# Altium project HUB_USB_3.0.PrjPcb (part 2 of 3)

## Sheet USB_HUB1 DN PORT 1_2.SchDoc: USB_HUB 3.0
size A2; DrawnBy: Luca Schenetti; Revision: A; SheetNumber: 6; SheetTotal: 10
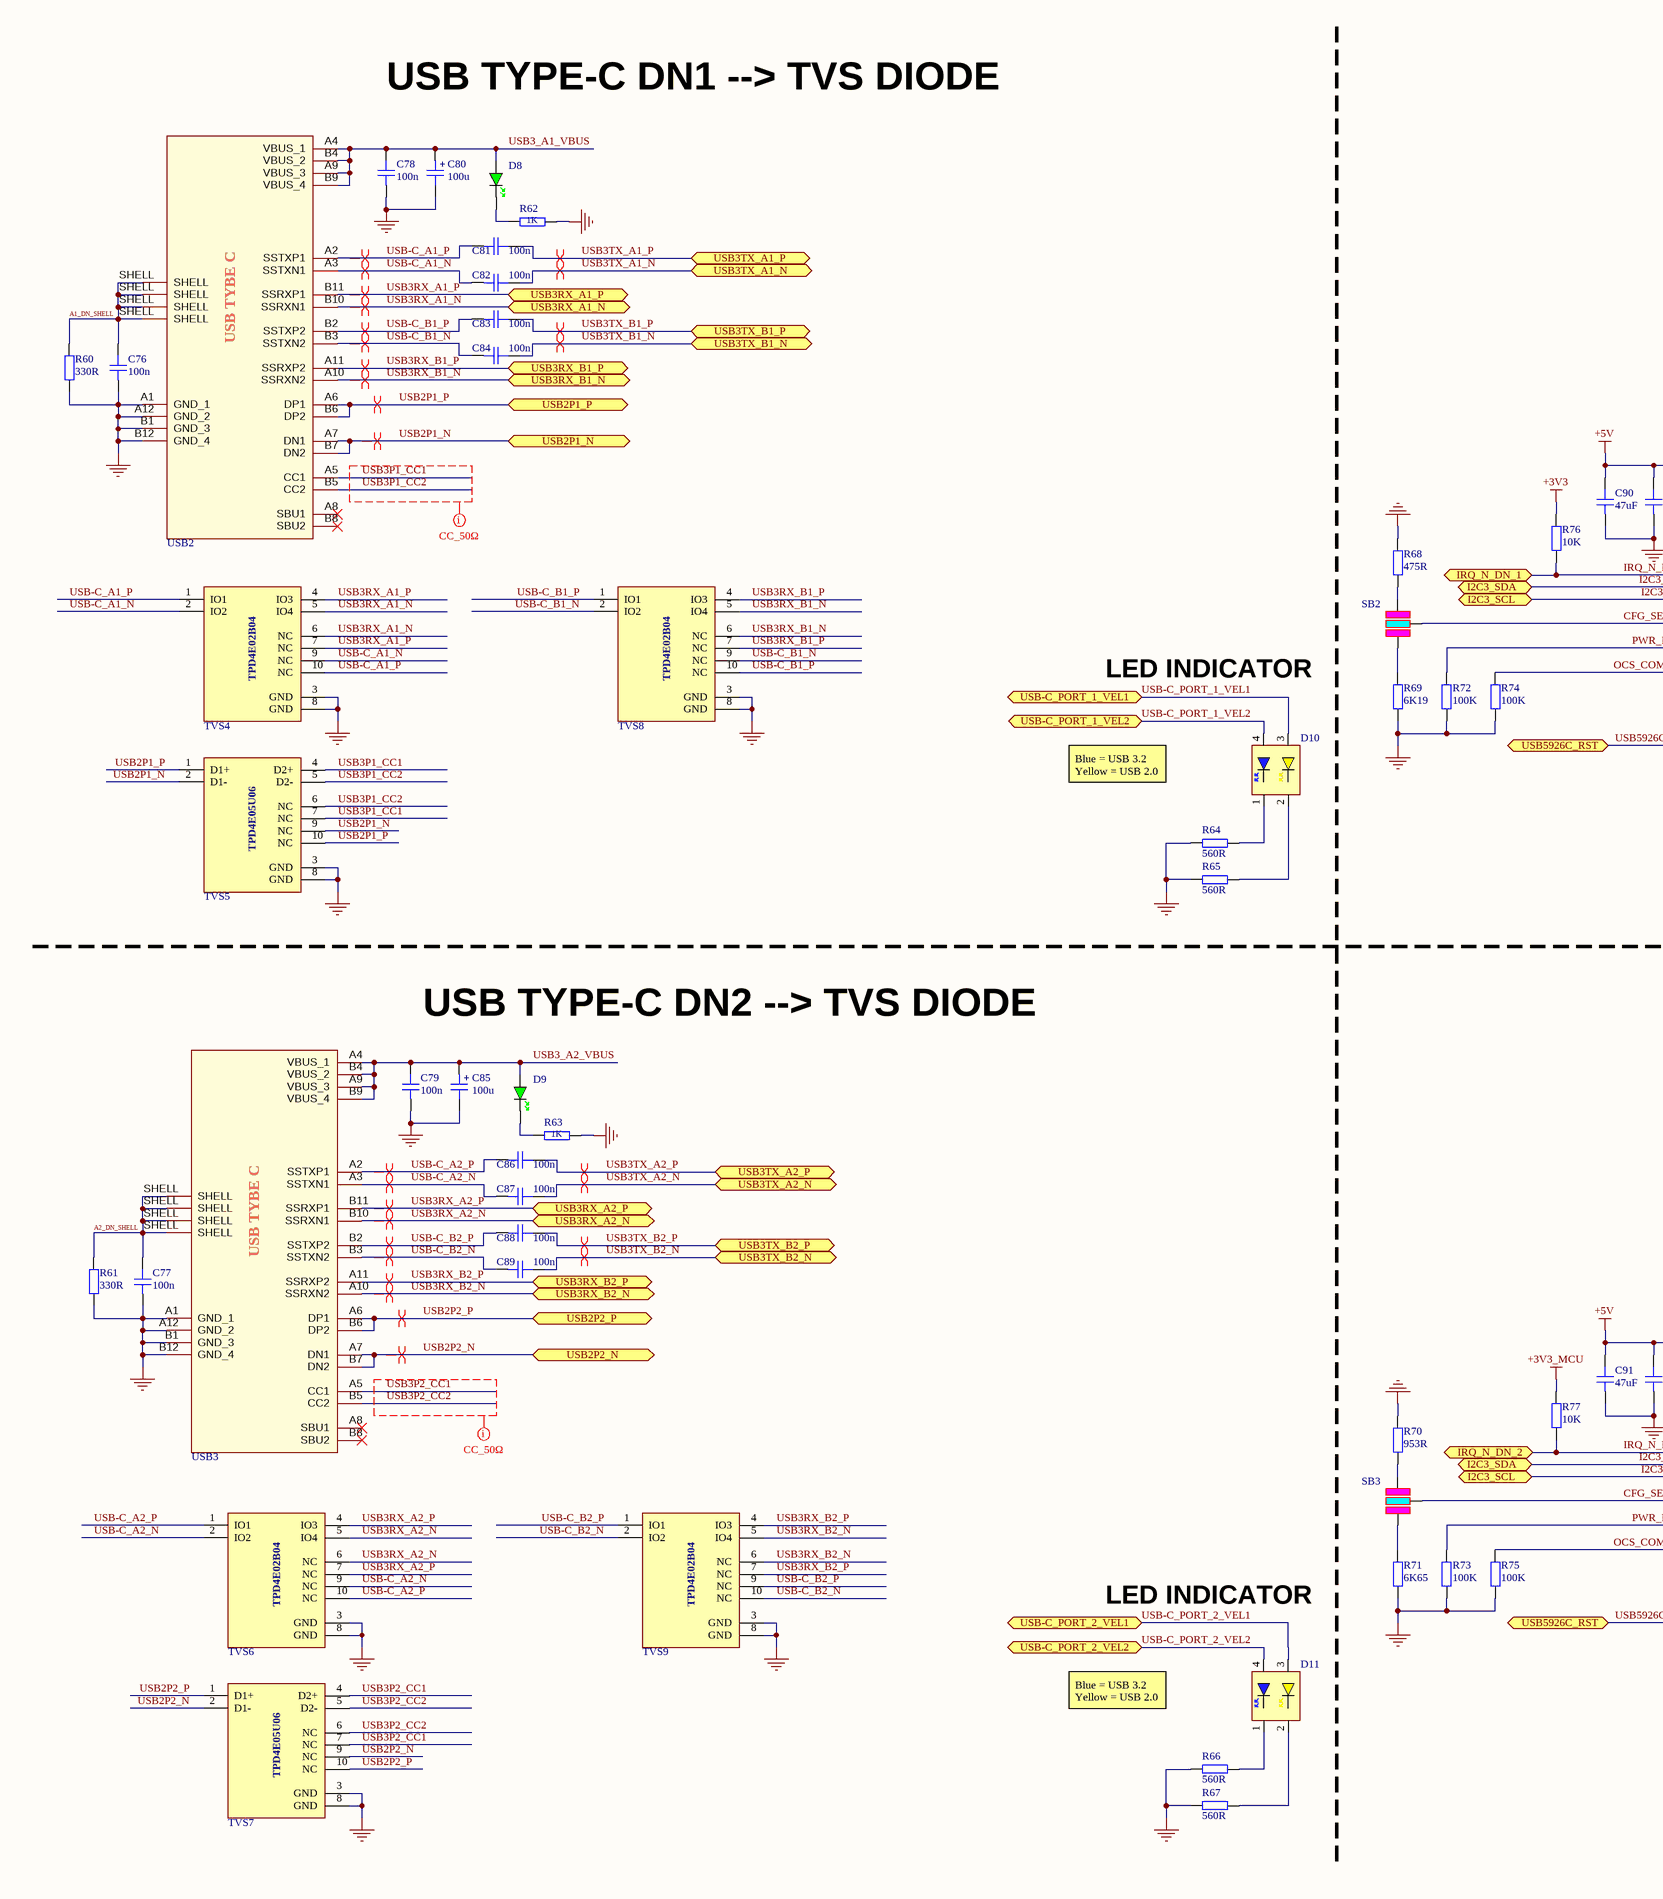
[diagram p9: USB_HUB1 DN PORT 1_2.SchDoc, left]
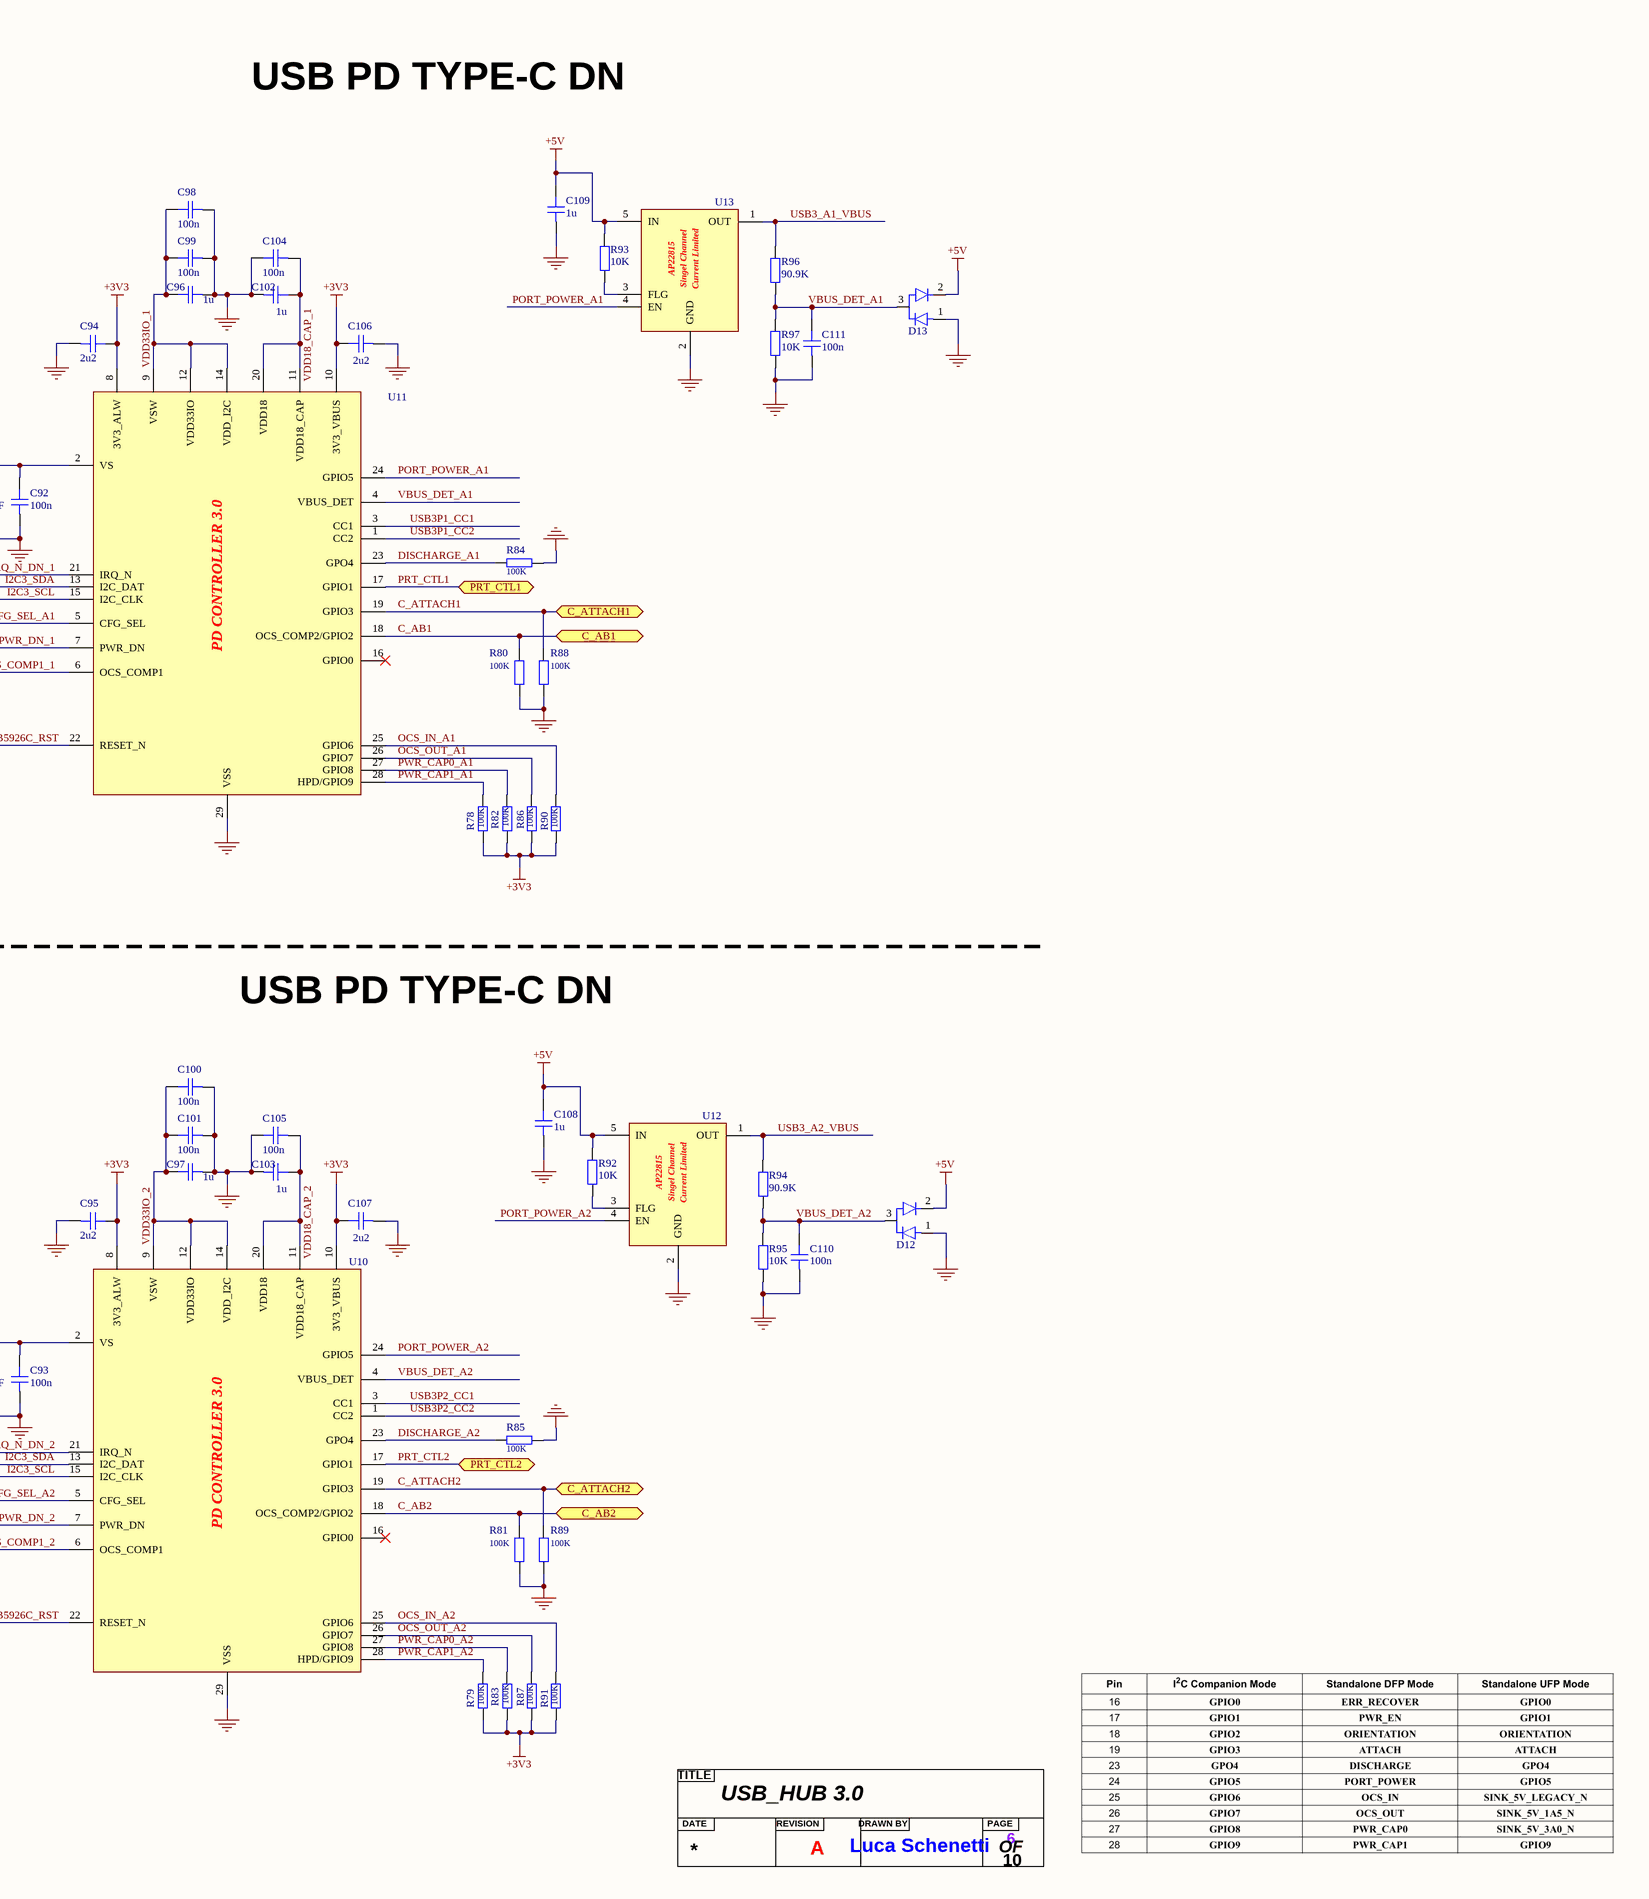
[diagram p10: USB_HUB1 DN PORT 1_2.SchDoc, right]

### Parts
(Parts that share a designator on the sheet are numbered #1, #2 ... from top to bottom, then left to right.)
?#6  Title  (value not drawn)  (graphical)
C76  100n  [CAP_0603]
C77  100n  [CAP_0603]
C78  100n  [CAP_0603]
C79  100n  [CAP_0603]
C80  100u  [CAP_AE_SMD_D6MM3_H5M55]
C81  100n  [CAP_0402]
C82  100n  [CAP_0402]
C83  100n  [CAP_0402]
C84  100n  [CAP_0402]
C85  100u  [CAP_AE_SMD_D6MM3_H5M55]
C86  100n  [CAP_0402]
C87  100n  [CAP_0402]
C88  100n  [CAP_0402]
C89  100n  [CAP_0402]
C90  47uF  [CAP_0603]
C91  47uF  [CAP_0603]
C92  100n  [CAP_0603]
C93  100n  [CAP_0603]
C94  2u2  [CAP_0603]
C95  2u2  [CAP_0603]
C96  1u  [CAP_0603]
C97  1u  [CAP_0603]
C98  100n  [CAP_0603]
C99  100n  [CAP_0603]
C100  100n  [CAP_0603]
C101  100n  [CAP_0603]
C102  1u  [CAP_0603]
C103  1u  [CAP_0603]
C104  100n  [CAP_0603]
C105  100n  [CAP_0603]
C106  2u2  [CAP_0603]
C107  2u2  [CAP_0603]
C108  1u  [CAP_0603]
C109  1u  [CAP_0603]
C110  100n  [CAP_0603]
C111  100n  [CAP_0603]
D8  GREEN  [LED_0603_GREEN]  (value not drawn)
D9  GREEN  [LED_0603_GREEN]  (value not drawn)
D10  TWO LED Yellow Blue 0603  [A-SP1962Y3B1C-C01-3T]  (value not drawn)
D11  TWO LED Yellow Blue 0603  [A-SP1962Y3B1C-C01-3T]  (value not drawn)
D12  High-Speed Switching Diode  [BAV99,215]  (value not drawn)
D13  High-Speed Switching Diode  [BAV99,215]  (value not drawn)
R60  330R  [RES_0603]
R61  330R  [RES_0603]
R62  1K  [RES_0603]
R63  1K  [RES_0603]
R64  560R  [RES_0603]
R65  560R  [RES_0603]
R66  560R  [RES_0603]
R67  560R  [RES_0603]
R68  475R  [RES_0603]
R69  6K19  [RES_0603]
R70  953R  [RES_0603]
R71  6K65  [RES_0603]
R72  100K  [RES_0603]
R73  100K  [RES_0603]
R74  100K  [RES_0603]
R75  100K  [RES_0603]
R76  10K  [RES_0603]
R77  10K  [RES_0603]
R78  100K  [RES_0603]
R79  100K  [RES_0603]
R80  100K  [RES_0603]
R81  100K  [RES_0603]
R82  100K  [RES_0603]
R83  100K  [RES_0603]
R84  100K  [RES_0603]
R85  100K  [RES_0603]
R86  100K  [RES_0603]
R87  100K  [RES_0603]
R88  100K  [RES_0603]
R89  100K  [RES_0603]
R90  100K  [RES_0603]
R91  100K  [RES_0603]
R92  10K  [RES_0603]
R93  10K  [RES_0603]
R94  90.9K  [RES_0603]
R95  10K  [RES_0603]
R96  90.9K  [RES_0603]
R97  10K  [RES_0603]
SB2  SOLDER BBRIDGE 3W  [SOLDER BRIDBE 3W]  (value not drawn)
SB3  SOLDER BBRIDGE 3W  [SOLDER BRIDBE 3W]  (value not drawn)
TVS4  TVS DIODE USB 3  [TPD4E02B04DQAR]  (value not drawn)
TVS5  ESD and Surge Protection USB, HDMI & High Speed  [TPD4E05U06DQAR]  (value not drawn)
TVS6  TVS DIODE USB 3  [TPD4E02B04DQAR]  (value not drawn)
TVS7  ESD and Surge Protection USB, HDMI & High Speed  [TPD4E05U06DQAR]  (value not drawn)
TVS8  TVS DIODE USB 3  [TPD4E02B04DQAR]  (value not drawn)
TVS9  TVS DIODE USB 3  [TPD4E02B04DQAR]  (value not drawn)
U10  USB Type-C® PD 3.0 Port Controller  [UPD350AT/Q8X]  (value not drawn)
U11  USB Type-C® PD 3.0 Port Controller  [UPD350AT/Q8X]  (value not drawn)
U12  Single-Channel, Current-Limited  [AP22815]  (value not drawn)
U13  Single-Channel, Current-Limited  [AP22815]  (value not drawn)
USB2  TYPE-C 24P QCHT  [TYPE-C 24P QCHT]  (value not drawn)
USB3  TYPE-C 24P QCHT  [TYPE-C 24P QCHT]  (value not drawn)

### Ports
C_AB1 (bidir, see USB_HUB1[3C]), C_AB2 (bidir, see USB_HUB1[3C]), C_ATTACH1 (bidir, see USB_HUB1[3C]), C_ATTACH2 (bidir, see USB_HUB1[3C]), I2C3_SCL (bidir, see MCU[2C], PWR[4B], PWR[11A], USB_HUB1 DN PORT 1_2[5B], USB_HUB1 UP PORT0[5B]), I2C3_SCL (bidir, see MCU[2C], PWR[4B], PWR[11A], USB_HUB1 DN PORT 1_2[5D], USB_HUB1 UP PORT0[5B]), I2C3_SDA (bidir, see MCU[4C], PWR[4B], PWR[11A], USB_HUB1 DN PORT 1_2[5B], USB_HUB1 UP PORT0[5B]), I2C3_SDA (bidir, see MCU[4C], PWR[4B], PWR[11A], USB_HUB1 DN PORT 1_2[5D], USB_HUB1 UP PORT0[5B]), IRQ_N_DN_1 (bidir, see MCU[2C]), IRQ_N_DN_2 (bidir, see MCU[2C]), PRT_CTL1 (bidir, see USB_HUB1[6D]), PRT_CTL2 (bidir, see USB_HUB1[6D]), USB2P1_N (bidir, see USB_HUB1[6B]), USB2P1_P (bidir, see USB_HUB1[6B]), USB2P2_N (bidir, see USB_HUB1[6C]), USB2P2_P (bidir, see USB_HUB1[6C]), USB3RX_A1_N (bidir, see USB_HUB1[6B]), USB3RX_A1_P (bidir, see USB_HUB1[6B]), USB3RX_A2_N (bidir, see USB_HUB1[6C]), USB3RX_A2_P (bidir, see USB_HUB1[6C]), USB3RX_B1_N (bidir, see USB_HUB1[6C]), USB3RX_B1_P (bidir, see USB_HUB1[6C]), USB3RX_B2_N (bidir, see USB_HUB1[6C]), USB3RX_B2_P (bidir, see USB_HUB1[6C]), USB3TX_A1_N (bidir, see USB_HUB1[6B]), USB3TX_A1_P (bidir, see USB_HUB1[6B]), USB3TX_A2_N (bidir, see USB_HUB1[6C]), USB3TX_A2_P (bidir, see USB_HUB1[6C]), USB3TX_B1_N (bidir, see USB_HUB1[6C]), USB3TX_B1_P (bidir, see USB_HUB1[6C]), USB3TX_B2_N (bidir, see USB_HUB1[6C]), USB3TX_B2_P (bidir, see USB_HUB1[6C]), USB5926C_RST (bidir, see MCU[8C], USB_HUB1 DN PORT 1_2[5B], USB_HUB1 DN PORT 5[3D], USB_HUB1 DN PORT 6[1C], USB_HUB1 UP PORT0[5C], USB_HUB1[3C]), USB5926C_RST (bidir, see MCU[8C], USB_HUB1 DN PORT 1_2[5D], USB_HUB1 DN PORT 5[3D], USB_HUB1 DN PORT 6[1C], USB_HUB1 UP PORT0[5C], USB_HUB1[3C]), USB-C_PORT_1_VEL1 (bidir, see MCU[2C]), USB-C_PORT_1_VEL2 (bidir, see MCU[2C]), USB-C_PORT_2_VEL1 (bidir, see MCU[4D]), USB-C_PORT_2_VEL2 (bidir, see MCU[4D])

### Nets
+3V3: C94.2 C95.2 C106.2 C107.2 R76.2 R78.1 R79.1 R82.1 R83.1 R86.1 R87.1 R90.1 R91.1 U10.8(3V3_ALW) U10.10(3V3_VBUS) U11.8(3V3_ALW) U11.10(3V3_VBUS)
+3V3_MCU: R77.2
+5V: C90.2 C91.2 C92.2 C93.2 C108.2 C109.2 D12.2 D13.2 R92.2 R93.2 U10.2(VS) U11.2(VS) U12.5(IN) U13.5(IN)
GND: C76.1 C77.1 C78.1 C79.1 C80.2 C85.2 C90.1 C91.1 C92.1 C93.1 C94.1 C95.1 C96.1 C97.1 C98.1 C99.1 C100.1 C101.1 C102.1 C103.1 C104.2 C105.2 C106.1 C107.1 C108.1 C109.1 C110.1 C111.1 D12.1 D13.1 R60.1 R61.1 R62.2 R63.2 R64.2 R65.2 R66.2 R67.2 R68.2 R69.1 R70.2 R71.1 R72.1 R73.1 R74.1 R75.1 R80.1 R81.1 R84.1 R85.1 R88.1 R89.1 R95.1 R97.1 TVS4.3(GND) TVS4.8(GND) TVS5.3(GND) TVS5.8(GND) TVS6.3(GND) TVS6.8(GND) TVS7.3(GND) TVS7.8(GND) TVS8.3(GND) TVS8.8(GND) TVS9.3(GND) TVS9.8(GND) U10.29(VSS) U11.29(VSS) U12.2(GND) U13.2(GND) USB2.A1(GND_1) USB2.A12(GND_2) USB2.B1(GND_3) USB2.B12(GND_4) USB3.A1(GND_1) USB3.A12(GND_2) USB3.B1(GND_3) USB3.B12(GND_4)
A1_DN_SHELL: C76.2 R60.2 USB2.SHELL
A2_DN_SHELL: C77.2 R61.2 USB3.SHELL
C_AB1: R80.2 U11.18(OCS_COMP2/GPIO2) ; port C_AB1
C_AB2: R81.2 U10.18(OCS_COMP2/GPIO2) ; port C_AB2
C_ATTACH1: R88.2 U11.19(GPIO3) ; port C_ATTACH1
C_ATTACH2: R89.2 U10.19(GPIO3) ; port C_ATTACH2
CFG_SEL_A1: SB2.1 U11.5(CFG_SEL)
CFG_SEL_A2: SB3.1 U10.5(CFG_SEL)
DISCHARGE_A1: R84.2 U11.23(GPO4)
DISCHARGE_A2: R85.2 U10.23(GPO4)
I2C3_SCL: U10.15(I2C_CLK) U11.15(I2C_CLK) ; port I2C3_SCL
I2C3_SDA: U10.13(I2C_DAT) U11.13(I2C_DAT) ; port I2C3_SDA
IRQ_N_DN_1: R76.1 U11.21(IRQ_N) ; port IRQ_N_DN_1
IRQ_N_DN_2: R77.1 U10.21(IRQ_N) ; port IRQ_N_DN_2
OCS_COMP1_1: R74.2 U11.6(OCS_COMP1)
OCS_COMP1_2: R75.2 U10.6(OCS_COMP1)
OCS_IN_A1: R90.2 U11.25(GPIO6)
OCS_IN_A2: R91.2 U10.25(GPIO6)
OCS_OUT_A1: R86.2 U11.26(GPIO7)
OCS_OUT_A2: R87.2 U10.26(GPIO7)
PORT_POWER_A1: U11.24(GPIO5) U13.4(EN)
PORT_POWER_A2: U10.24(GPIO5) U12.4(EN)
PRT_CTL1: U11.17(GPIO1) ; port PRT_CTL1
PRT_CTL2: U10.17(GPIO1) ; port PRT_CTL2
PWR_CAP0_A1: R82.2 U11.27(GPIO8)
PWR_CAP0_A2: R83.2 U10.27(GPIO8)
PWR_CAP1_A1: R78.2 U11.28(HPD/GPIO9)
PWR_CAP1_A2: R79.2 U10.28(HPD/GPIO9)
PWR_DN_1: R72.2 U11.7(PWR_DN)
PWR_DN_2: R73.2 U10.7(PWR_DN)
USB2P1_N: TVS5.2(D1-) TVS5.9(NC) USB2.A7(DN1) USB2.B7(DN2) ; port USB2P1_N
USB2P1_P: TVS5.1(D1+) TVS5.10(NC) USB2.A6(DP1) USB2.B6(DP2) ; port USB2P1_P
USB2P2_N: TVS7.2(D1-) TVS7.9(NC) USB3.A7(DN1) USB3.B7(DN2) ; port USB2P2_N
USB2P2_P: TVS7.1(D1+) TVS7.10(NC) USB3.A6(DP1) USB3.B6(DP2) ; port USB2P2_P
USB3_A1_VBUS: C78.2 C80.1 D8.A R96.2 U13.1(OUT) USB2.A4(VBUS_1) USB2.A9(VBUS_3) USB2.B4(VBUS_2) USB2.B9(VBUS_4)
USB3_A2_VBUS: C79.2 C85.1 D9.A R94.2 U12.1(OUT) USB3.A4(VBUS_1) USB3.A9(VBUS_3) USB3.B4(VBUS_2) USB3.B9(VBUS_4)
USB3P1_CC1: TVS5.4(D2+) TVS5.7(NC) U11.3(CC1) USB2.A5(CC1)
USB3P1_CC2: TVS5.5(D2-) TVS5.6(NC) U11.1(CC2) USB2.B5(CC2)
USB3P2_CC1: TVS7.4(D2+) TVS7.7(NC) U10.3(CC1) USB3.A5(CC1)
USB3P2_CC2: TVS7.5(D2-) TVS7.6(NC) U10.1(CC2) USB3.B5(CC2)
USB3RX_A1_N: TVS4.5(IO4) TVS4.6(NC) USB2.B10(SSRXN1) ; port USB3RX_A1_N
USB3RX_A1_P: TVS4.4(IO3) TVS4.7(NC) USB2.B11(SSRXP1) ; port USB3RX_A1_P
USB3RX_A2_N: TVS6.5(IO4) TVS6.6(NC) USB3.B10(SSRXN1) ; port USB3RX_A2_N
USB3RX_A2_P: TVS6.4(IO3) TVS6.7(NC) USB3.B11(SSRXP1) ; port USB3RX_A2_P
USB3RX_B1_N: TVS8.5(IO4) TVS8.6(NC) USB2.A10(SSRXN2) ; port USB3RX_B1_N
USB3RX_B1_P: TVS8.4(IO3) TVS8.7(NC) USB2.A11(SSRXP2) ; port USB3RX_B1_P
USB3RX_B2_N: TVS9.5(IO4) TVS9.6(NC) USB3.A10(SSRXN2) ; port USB3RX_B2_N
USB3RX_B2_P: TVS9.4(IO3) TVS9.7(NC) USB3.A11(SSRXP2) ; port USB3RX_B2_P
USB3TX_A1_N: C82.2 ; port USB3TX_A1_N
USB3TX_A1_P: C81.2 ; port USB3TX_A1_P
USB3TX_A2_N: C87.2 ; port USB3TX_A2_N
USB3TX_A2_P: C86.2 ; port USB3TX_A2_P
USB3TX_B1_N: C84.2 ; port USB3TX_B1_N
USB3TX_B1_P: C83.2 ; port USB3TX_B1_P
USB3TX_B2_N: C89.2 ; port USB3TX_B2_N
USB3TX_B2_P: C88.2 ; port USB3TX_B2_P
USB5926C_RST: U10.22(RESET_N) U11.22(RESET_N) ; port USB5926C_RST
USB-C_A1_N: C82.1 TVS4.2(IO2) TVS4.9(NC) USB2.A3(SSTXN1)
USB-C_A1_P: C81.1 TVS4.1(IO1) TVS4.10(NC) USB2.A2(SSTXP1)
USB-C_A2_N: C87.1 TVS6.2(IO2) TVS6.9(NC) USB3.A3(SSTXN1)
USB-C_A2_P: C86.1 TVS6.1(IO1) TVS6.10(NC) USB3.A2(SSTXP1)
USB-C_B1_N: C84.1 TVS8.2(IO2) TVS8.9(NC) USB2.B3(SSTXN2)
USB-C_B1_P: C83.1 TVS8.1(IO1) TVS8.10(NC) USB2.B2(SSTXP2)
USB-C_B2_N: C89.1 TVS9.2(IO2) TVS9.10(NC) USB3.B3(SSTXN2)
USB-C_B2_P: C88.1 TVS9.1(IO1) TVS9.9(NC) USB3.B2(SSTXP2)
USB-C_PORT_1_VEL1: D10.3 ; port USB-C_PORT_1_VEL1
USB-C_PORT_1_VEL2: D10.4 ; port USB-C_PORT_1_VEL2
USB-C_PORT_2_VEL1: D11.3 ; port USB-C_PORT_2_VEL1
USB-C_PORT_2_VEL2: D11.4 ; port USB-C_PORT_2_VEL2
VBUS_DET_A1: C111.2 D13.3 R96.1 R97.2 U11.4(VBUS_DET)
VBUS_DET_A2: C110.2 D12.3 R94.1 R95.2 U10.4(VBUS_DET)
VDD18_CAP_1: C102.2 C104.1 U11.11(VDD18_CAP) U11.20(VDD18)
VDD18_CAP_2: C103.2 C105.1 U10.11(VDD18_CAP) U10.20(VDD18)
VDD33IO_1: C96.2 C98.2 C99.2 U11.9(VSW) U11.12(VDD33IO) U11.14(VDD_I2C)
VDD33IO_2: C97.2 C100.2 C101.2 U10.9(VSW) U10.12(VDD33IO) U10.14(VDD_I2C)
NetD8_K: D8.K R62.1
NetD9_K: D9.K R63.1
NetD10_1: D10.1 R64.1
NetD10_2: D10.2 R65.1
NetD11_1: D11.1 R66.1
NetD11_2: D11.2 R67.1
NetR68_1: R68.1 SB2.2
NetR69_2: R69.2 SB2.0
NetR70_1: R70.1 SB3.2
NetR71_2: R71.2 SB3.0
NetR92_1: R92.1 U12.3(FLG)
NetR93_1: R93.1 U13.3(FLG)

Not connected (* = marked no-connect by the designer): U10 16(GPIO0)*; U11 16(GPIO0)*; USB2 A8(SBU1)* B8(SBU2)*; USB3 A8(SBU1)* B8(SBU2)*

### Layout directives
differential pair; differential pair class DIFF_USB_90Ω: USB2P1_N, USB2P1_P, USB2P2_N, USB2P2_P, USB3RX_A1_N, USB3RX_A1_P, USB3RX_A2_N, USB3RX_A2_P, USB3RX_B1_N, USB3RX_B1_P, USB3RX_B2_N, USB3RX_B2_P, USB3TX_A1_N, USB3TX_A1_P, USB3TX_A2_N, USB3TX_A2_P, USB3TX_B1_N, USB3TX_B1_P, USB3TX_B2_N, USB3TX_B2_P, USB-C_A1_N, USB-C_A1_P, USB-C_A2_N, USB-C_A2_P, USB-C_B1_N, USB-C_B1_P, USB-C_B2_N, USB-C_B2_P
net class CC_50Ω: USB3P1_CC1, USB3P1_CC2, USB3P2_CC1, USB3P2_CC2

### Notes on the sheet
- USB TYPE-C DN1 --> TVS DIODE
- USB PD TYPE-C DN
- (near R68) Companion Mode
  I2C Slave Address = 1011_110
- LED INDICATOR
- I2C Slave Address = 1101_010
  DFP STANDALONE
- Blue = USB 3.2
  Yellow = USB 2.0
- USB TYPE-C DN2 --> TVS DIODE
- (near R70) Companion Mode
  I2C Slave Address = 1011_101
- I2C Slave Address = 1101_001
  DFP STANDALONE
- (in symbol AP22815AWT-7) AP22815; Singel Channel; Current Limited
- (in symbol CAP_ALEL_6.3x5.5) +
- (in symbol Title) TITLE; DATE; REVISION; DRAWN BY; PAGE; OF
- (in symbol TPD4E02B04DQAR) TPD4E02B04
- (in symbol TPD4E05U06DQAR) TPD4E05U06
- (in symbol TYPE-C 24P QCHT) USB TYBE C
- (in symbol UPD350AT/Q8X) PD CONTROLLER 3.0

### Library data of the parts
C76-C79 C92 C93 C98-C101 C104 C105 C110 C111 = CAP_0603: Capacitor SMD 0603 [C14663]; Manufacturer: *; Manufacturer Part Number: *; Distributor Link: *; LCSC: *; Rating: *; Dielectric: *
C80 C85 = CAP_ALEL_6.3x5.5: [C59936]; Manufacturer: *; Manufacturer Part Number: *; Distributor Link: *; LCSC: *
C81-C84 C86-C89 = CAP_0402: Capacitor SMD 0402[C1525]; Manufacturer: *; Manufacturer Part Number: *; Distributor Link: *; LCSC: *; Rating: *; Dielectric: *
C90 C91 = CAP_0603: Capacitor SMD 0603 [C730416]; Manufacturer: *; Manufacturer Part Number: *; Distributor Link: *; LCSC: *; Rating: *; Dielectric: *
C94 C95 C106 C107 = CAP_0603: Capacitor SMD 0603 [C23630]; Manufacturer: *; Manufacturer Part Number: *; Distributor Link: *; LCSC: *; Rating: *; Dielectric: *
C96 C97 C102 C103 C108 C109 = CAP_0603: Capacitor SMD 0603 [C15849]; Manufacturer: *; Manufacturer Part Number: *; Distributor Link: *; LCSC: *; Rating: *; Dielectric: *
D8 D9 = LED_0603_GREEN: [C2986059]
D10 D11 = A-SP1962Y3B1C-C01-3T: [C19171299]
D12 D13 = BAV99,215: [C2500]
R60 R61 = RES_0603: [C23138]; Manufacturer: *; Manufacturer Part Number: *; Distributor Link: *; LCSC: *
R62 R63 = RES_0603: [C21190]; Manufacturer: *; Manufacturer Part Number: *; Distributor Link: *; LCSC: *
R64-R67 = RES_0603: [C23204]; Manufacturer: *; Manufacturer Part Number: *; Distributor Link: *; LCSC: *
R68 = RES_0603: [C23181]; Manufacturer: *; Manufacturer Part Number: *; Distributor Link: *; LCSC: *
R69 = RES_0603: [C25978]; Manufacturer: *; Manufacturer Part Number: *; Distributor Link: *; LCSC: *
R70 = RES_0603: [C93622]; Manufacturer: *; Manufacturer Part Number: *; Distributor Link: *; LCSC: *
R71 = RES_0603: [C3016441]; Manufacturer: *; Manufacturer Part Number: *; Distributor Link: *; LCSC: *
R72-R75 R78-R91 = RES_0603: [C25803]; Manufacturer: *; Manufacturer Part Number: *; Distributor Link: *; LCSC: *
R76 R77 = RES_0603: Resistor SMD 0603[C25804]; Manufacturer: *; Manufacturer Part Number: *; Distributor Link: *; LCSC: *
R92 R93 R95 R97 = RES_0603: [C25804]; Manufacturer: *; Manufacturer Part Number: *; Distributor Link: *; LCSC: *
R94 R96 = RES_0603: [C23129]; Manufacturer: *; Manufacturer Part Number: *; Distributor Link: *; LCSC: *
TVS4 TVS6 TVS8 TVS9 = TPD4E02B04DQAR: [C106794]
TVS5 TVS7 = TPD4E05U06DQAR: [C138714]
U10 U11 = UPD350AT/Q8X: [C622602]
U12 U13 = AP22815AWT-7: [C2150007]
USB2 USB3 = TYPE-C 24P QCHT: [C456013]

## Sheet USB_HUB1 DN PORT 3.SchDoc: USB_HUB 3.0
size A2; DrawnBy: Luca Schenetti; Revision: A; SheetNumber: 7; SheetTotal: 10
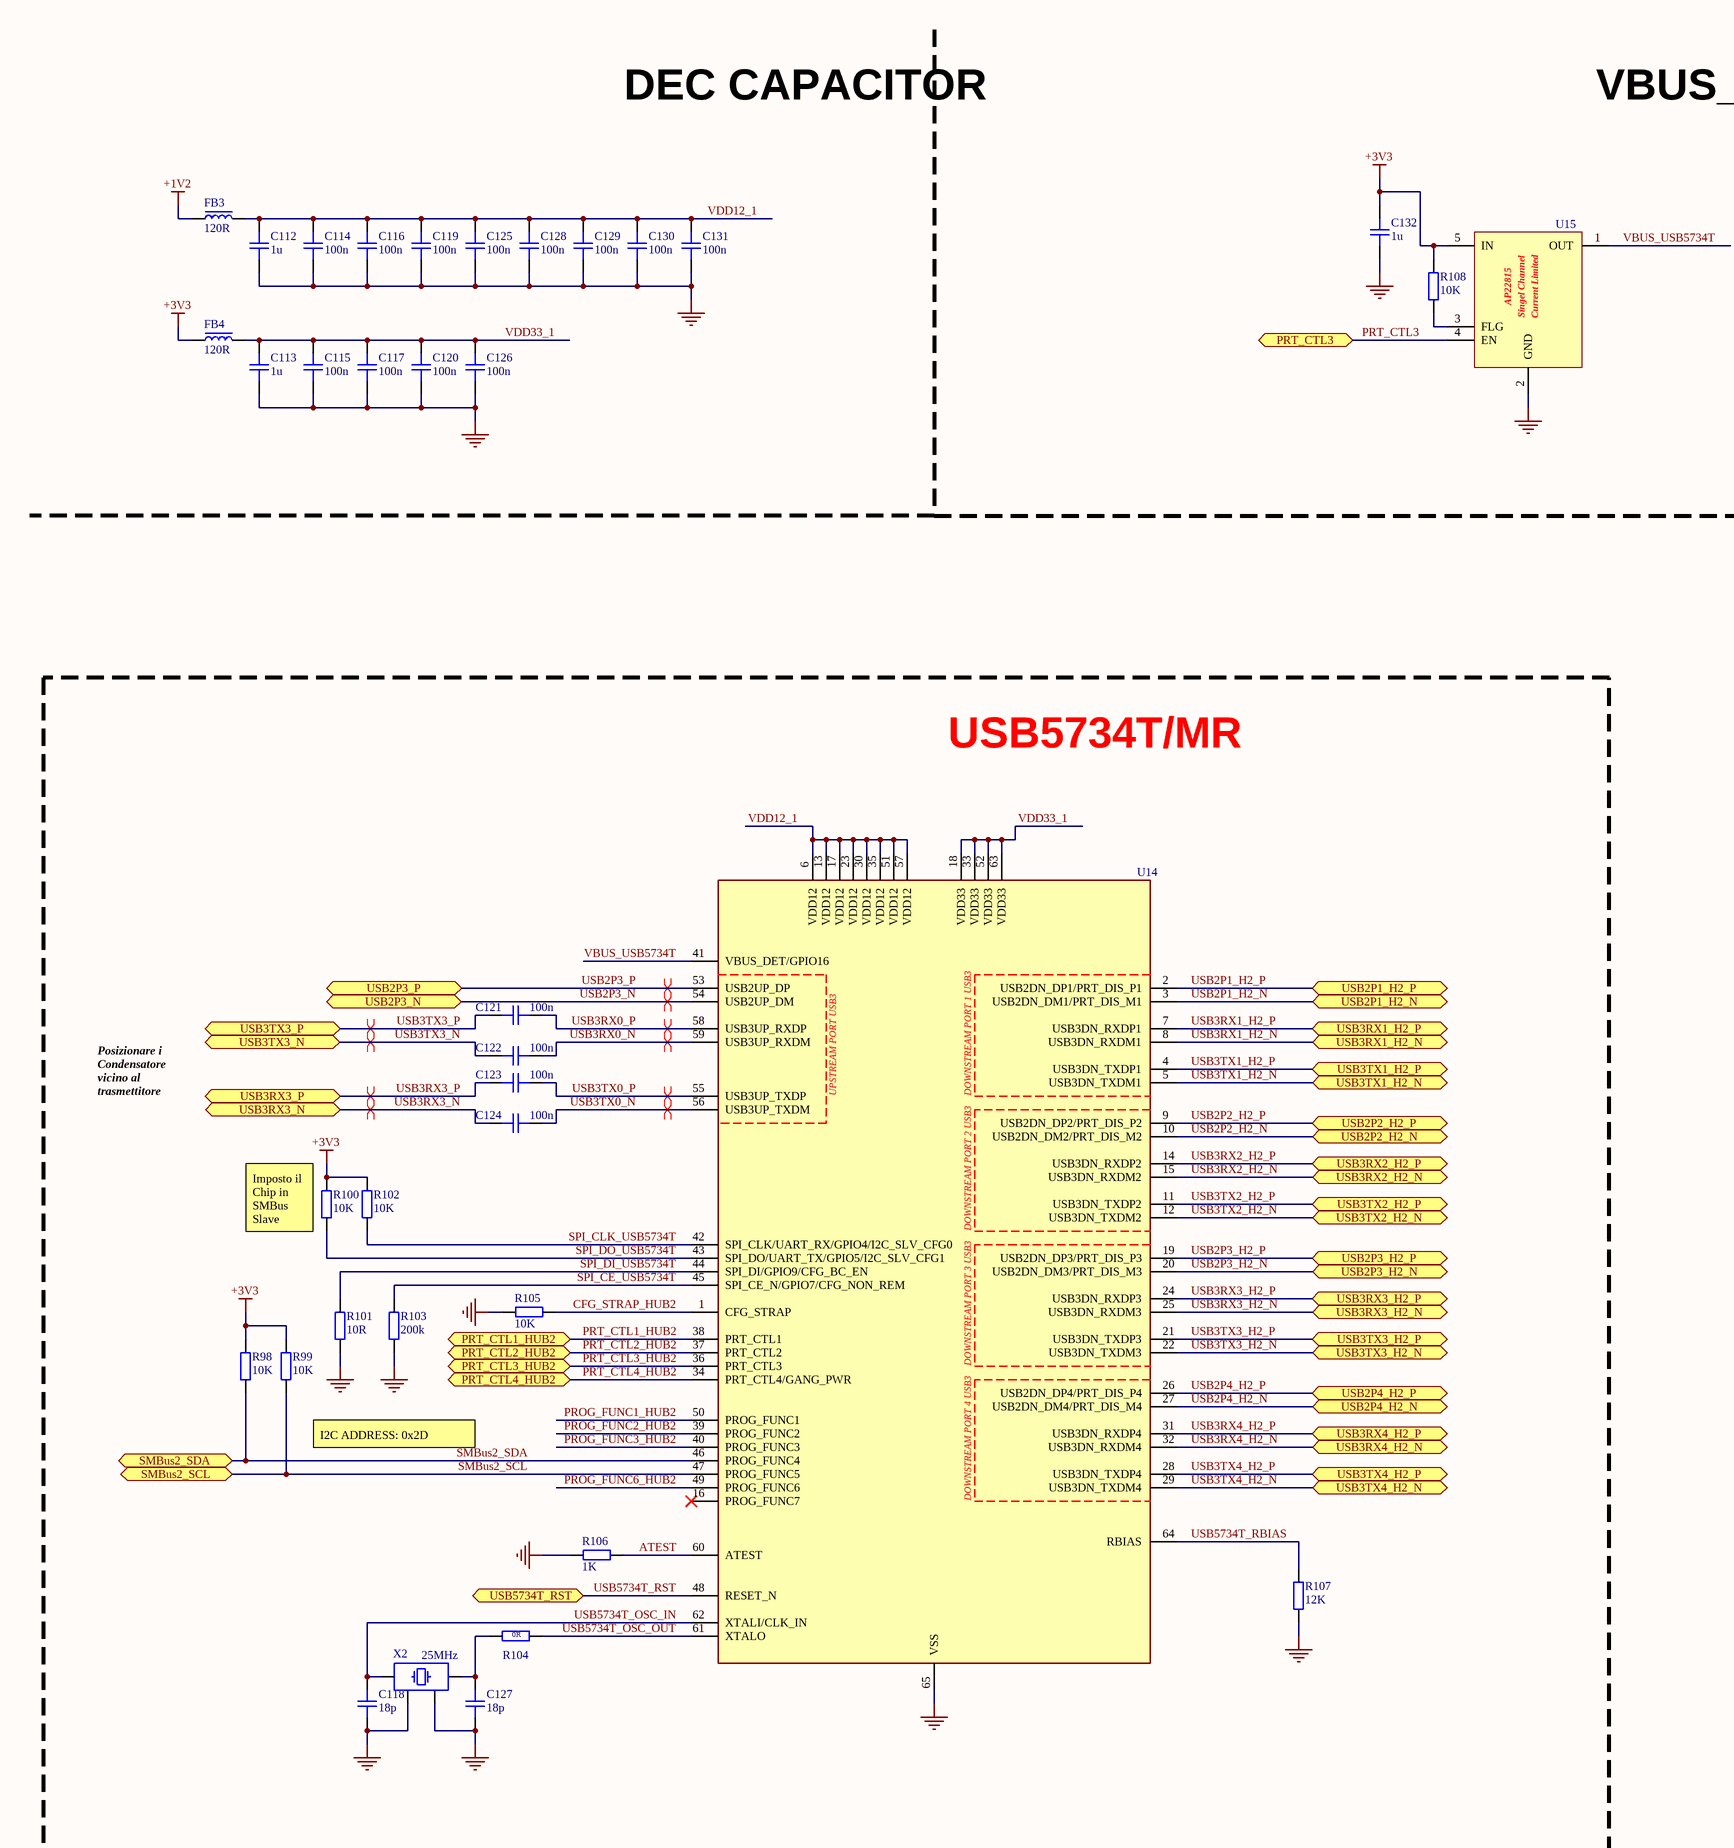
[diagram p11: USB_HUB1 DN PORT 3.SchDoc, left]
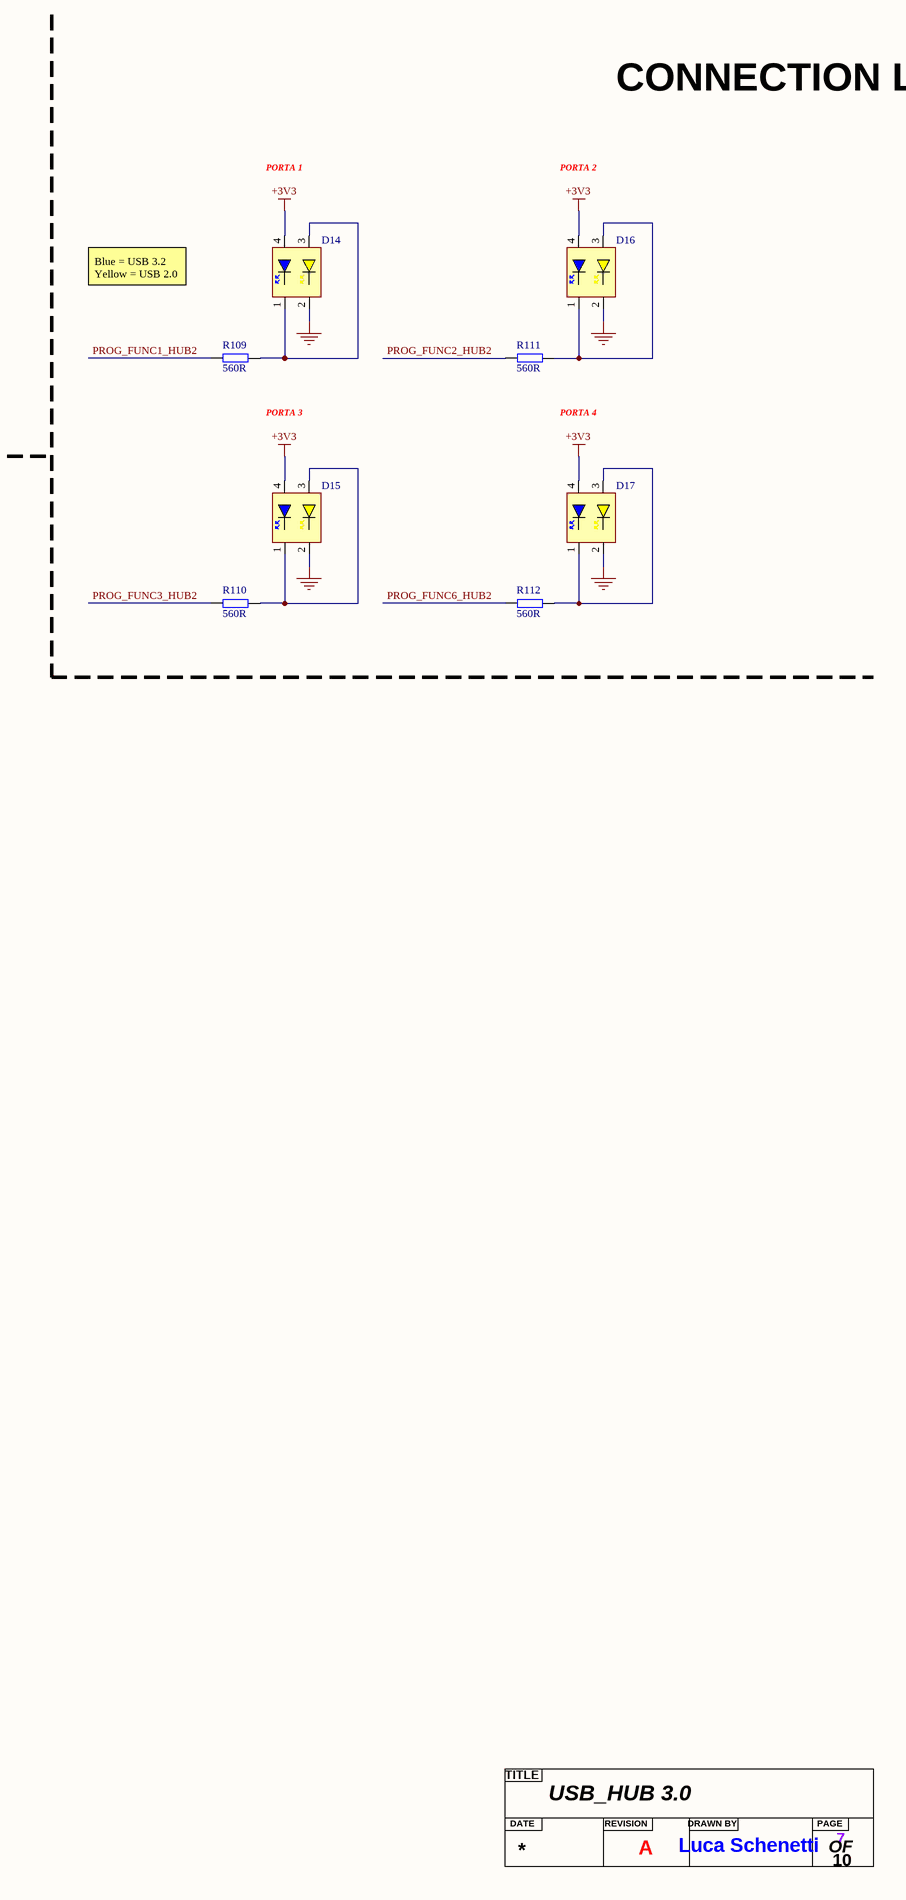
[diagram p12: USB_HUB1 DN PORT 3.SchDoc, right]

### Parts
(Parts that share a designator on the sheet are numbered #1, #2 ... from top to bottom, then left to right.)
?#7  Title  (value not drawn)  (graphical)
C112  1u  [CAP_0603]
C113  1u  [CAP_0603]
C114  100n  [CAP_0603]
C115  100n  [CAP_0603]
C116  100n  [CAP_0603]
C117  100n  [CAP_0603]
C118  18p  [CAP_0402]
C119  100n  [CAP_0603]
C120  100n  [CAP_0603]
C121  100n  [CAP_0402]
C122  100n  [CAP_0402]
C123  100n  [CAP_0402]
C124  100n  [CAP_0402]
C125  100n  [CAP_0603]
C126  100n  [CAP_0603]
C127  18p  [CAP_0402]
C128  100n  [CAP_0603]
C129  100n  [CAP_0603]
C130  100n  [CAP_0603]
C131  100n  [CAP_0603]
C132  1u  [CAP_0603]
D14  TWO LED Yellow Blue 0603  [A-SP1962Y3B1C-C01-3T]  (value not drawn)
D15  TWO LED Yellow Blue 0603  [A-SP1962Y3B1C-C01-3T]  (value not drawn)
D16  TWO LED Yellow Blue 0603  [A-SP1962Y3B1C-C01-3T]  (value not drawn)
D17  TWO LED Yellow Blue 0603  [A-SP1962Y3B1C-C01-3T]  (value not drawn)
FB3  120R  [FB_0603]
FB4  120R  [FB_0603]
R98  10K  [RES_0603]
R99  10K  [RES_0603]
R100  10K  [RES_0603]
R101  10R  [RES_0603]
R102  10K  [RES_0603]
R103  200k  [RES_0603]
R104  0R  [RES_0402]
R105  10K  [RES_0603]
R106  1K  [RES_0603]
R107  12K  [RES_0603]
R108  10K  [RES_0603]
R109  560R  [RES_0603]
R110  560R  [RES_0603]
R111  560R  [RES_0603]
R112  560R  [RES_0603]
U14  4-Port SS/HS USB Controller Hub  [USB5734T/MR]  (value not drawn)
U15  Single-Channel, Current-Limited  [AP22815]  (value not drawn)
X2  25MHz  [XTAL_3225]

### Blocks framed on the sheet
USB5734T/MR: C118 C121-C124 C127 R98-R107 U14 X2

### Ports
PRT_CTL1_HUB2 (bidir, see USB_HUB2 DN PORT[2C]), PRT_CTL2_HUB2 (bidir, see USB_HUB2 DN PORT[2D]), PRT_CTL3 (bidir, see USB_HUB1[6D]), PRT_CTL3_HUB2 (bidir, see USB_HUB2 DN PORT[5C]), PRT_CTL4_HUB2 (bidir, see USB_HUB2 DN PORT[5D]), SMBus2_SCL (bidir, see MCU[4D]), SMBus2_SDA (bidir, see MCU[4C]), USB2P1_H2_N (bidir, see USB_HUB2 DN PORT[3A], USB_HUB2 DN PORT[3B]), USB2P1_H2_P (bidir, see USB_HUB2 DN PORT[3A], USB_HUB2 DN PORT[3B]), USB2P2_H2_N (bidir, see USB_HUB2 DN PORT[3A], USB_HUB2 DN PORT[3B]), USB2P2_H2_P (bidir, see USB_HUB2 DN PORT[3A], USB_HUB2 DN PORT[3B]), USB2P3_H2_N (bidir, see USB_HUB2 DN PORT[6B], USB_HUB2 DN PORT[7A]), USB2P3_H2_P (bidir, see USB_HUB2 DN PORT[6B], USB_HUB2 DN PORT[7A]), USB2P3_N (bidir, see USB_HUB1[6C]), USB2P3_P (bidir, see USB_HUB1[6C]), USB2P4_H2_N (bidir, see USB_HUB2 DN PORT[6B], USB_HUB2 DN PORT[7A]), USB2P4_H2_P (bidir, see USB_HUB2 DN PORT[6B], USB_HUB2 DN PORT[7A]), USB3RX1_H2_N (bidir, see USB_HUB2 DN PORT[3A]), USB3RX1_H2_P (bidir, see USB_HUB2 DN PORT[3A]), USB3RX2_H2_N (bidir, see USB_HUB2 DN PORT[3A]), USB3RX2_H2_P (bidir, see USB_HUB2 DN PORT[3A]), USB3RX3_H2_N (bidir, see USB_HUB2 DN PORT[7A]), USB3RX3_H2_P (bidir, see USB_HUB2 DN PORT[7A]), USB3RX3_N (bidir, see USB_HUB1[6C]), USB3RX3_P (bidir, see USB_HUB1[6C]), USB3RX4_H2_N (bidir, see USB_HUB2 DN PORT[7A]), USB3RX4_H2_P (bidir, see USB_HUB2 DN PORT[7A]), USB3TX1_H2_N (bidir, see USB_HUB2 DN PORT[3A]), USB3TX1_H2_P (bidir, see USB_HUB2 DN PORT[3A]), USB3TX2_H2_N (bidir, see USB_HUB2 DN PORT[3A]), USB3TX2_H2_P (bidir, see USB_HUB2 DN PORT[3A]), USB3TX3_H2_N (bidir, see USB_HUB2 DN PORT[7A]), USB3TX3_H2_P (bidir, see USB_HUB2 DN PORT[7A]), USB3TX3_N (bidir, see USB_HUB1[6C]), USB3TX3_P (bidir, see USB_HUB1[6C]), USB3TX4_H2_N (bidir, see USB_HUB2 DN PORT[7A]), USB3TX4_H2_P (bidir, see USB_HUB2 DN PORT[7A]), USB5734T_RST (bidir, see MCU[8C])

### Nets
+1V2: FB3.1
+3V3: C132.2 D14.4 D15.4 D16.4 D17.4 FB4.1 R98.2 R99.2 R100.2 R102.2 R108.2 U15.5(IN)
GND: C112.1 C113.1 C114.1 C115.1 C116.1 C117.1 C118.1 C119.1 C120.1 C125.1 C126.1 C127.1 C128.1 C129.1 C130.1 C131.1 C132.1 D14.2 D15.2 D16.2 D17.2 R101.1 R103.1 R105.2 R106.2 R107.1 U14.65(VSS) U15.2(GND) X2.2 X2.4
ATEST: R106.1 U14.60(ATEST)
CFG_STRAP_HUB2: R105.1 U14.1(CFG_STRAP)
PROG_FUNC1_HUB2: R109.2 U14.50(PROG_FUNC1)
PROG_FUNC2_HUB2: R111.2 U14.39(PROG_FUNC2)
PROG_FUNC3_HUB2: R110.2 U14.40(PROG_FUNC3)
PROG_FUNC6_HUB2: R112.2 U14.49(PROG_FUNC6)
PRT_CTL1_HUB2: U14.38(PRT_CTL1) ; port PRT_CTL1_HUB2
PRT_CTL2_HUB2: U14.37(PRT_CTL2) ; port PRT_CTL2_HUB2
PRT_CTL3: U15.4(EN) ; port PRT_CTL3
PRT_CTL3_HUB2: U14.36(PRT_CTL3) ; port PRT_CTL3_HUB2
PRT_CTL4_HUB2: U14.34(PRT_CTL4/GANG_PWR) ; port PRT_CTL4_HUB2
SMBus2_SCL: R99.1 U14.47(PROG_FUNC5) ; port SMBus2_SCL
SMBus2_SDA: R98.1 U14.46(PROG_FUNC4) ; port SMBus2_SDA
SPI_CE_USB5734T: R103.2 U14.45(SPI_CE_N/GPIO7/CFG_NON_REM)
SPI_CLK_USB5734T: R102.1 U14.42(SPI_CLK/UART_RX/GPIO4/I2C_SLV_CFG0)
SPI_DI_USB5734T: R101.2 U14.44(SPI_DI/GPIO9/CFG_BC_EN)
SPI_DO_USB5734T: R100.1 U14.43(SPI_DO/UART_TX/GPIO5/I2C_SLV_CFG1)
USB2P1_H2_N: U14.3(USB2DN_DM1/PRT_DIS_M1) ; port USB2P1_H2_N
USB2P1_H2_P: U14.2(USB2DN_DP1/PRT_DIS_P1) ; port USB2P1_H2_P
USB2P2_H2_N: U14.10(USB2DN_DM2/PRT_DIS_M2) ; port USB2P2_H2_N
USB2P2_H2_P: U14.9(USB2DN_DP2/PRT_DIS_P2) ; port USB2P2_H2_P
USB2P3_H2_N: U14.20(USB2DN_DM3/PRT_DIS_M3) ; port USB2P3_H2_N
USB2P3_H2_P: U14.19(USB2DN_DP3/PRT_DIS_P3) ; port USB2P3_H2_P
USB2P3_N: U14.54(USB2UP_DM) ; port USB2P3_N
USB2P3_P: U14.53(USB2UP_DP) ; port USB2P3_P
USB2P4_H2_N: U14.27(USB2DN_DM4/PRT_DIS_M4) ; port USB2P4_H2_N
USB2P4_H2_P: U14.26(USB2DN_DP4/PRT_DIS_P4) ; port USB2P4_H2_P
USB3RX0_N: C122.1 U14.59(USB3UP_RXDM)
USB3RX0_P: C121.1 U14.58(USB3UP_RXDP)
USB3RX1_H2_N: U14.8(USB3DN_RXDM1) ; port USB3RX1_H2_N
USB3RX1_H2_P: U14.7(USB3DN_RXDP1) ; port USB3RX1_H2_P
USB3RX2_H2_N: U14.15(USB3DN_RXDM2) ; port USB3RX2_H2_N
USB3RX2_H2_P: U14.14(USB3DN_RXDP2) ; port USB3RX2_H2_P
USB3RX3_H2_N: U14.25(USB3DN_RXDM3) ; port USB3RX3_H2_N
USB3RX3_H2_P: U14.24(USB3DN_RXDP3) ; port USB3RX3_H2_P
USB3RX3_N: C124.2 ; port USB3RX3_N
USB3RX3_P: C123.2 ; port USB3RX3_P
USB3RX4_H2_N: U14.32(USB3DN_RXDM4) ; port USB3RX4_H2_N
USB3RX4_H2_P: U14.31(USB3DN_RXDP4) ; port USB3RX4_H2_P
USB3TX0_N: C124.1 U14.56(USB3UP_TXDM)
USB3TX0_P: C123.1 U14.55(USB3UP_TXDP)
USB3TX1_H2_N: U14.5(USB3DN_TXDM1) ; port USB3TX1_H2_N
USB3TX1_H2_P: U14.4(USB3DN_TXDP1) ; port USB3TX1_H2_P
USB3TX2_H2_N: U14.12(USB3DN_TXDM2) ; port USB3TX2_H2_N
USB3TX2_H2_P: U14.11(USB3DN_TXDP2) ; port USB3TX2_H2_P
USB3TX3_H2_N: U14.22(USB3DN_TXDM3) ; port USB3TX3_H2_N
USB3TX3_H2_P: U14.21(USB3DN_TXDP3) ; port USB3TX3_H2_P
USB3TX3_N: C122.2 ; port USB3TX3_N
USB3TX3_P: C121.2 ; port USB3TX3_P
USB3TX4_H2_N: U14.29(USB3DN_TXDM4) ; port USB3TX4_H2_N
USB3TX4_H2_P: U14.28(USB3DN_TXDP4) ; port USB3TX4_H2_P
USB5734T_OSC_IN: C118.2 U14.62(XTALI/CLK_IN) X2.3
USB5734T_OSC_OUT: R104.2 U14.61(XTALO)
USB5734T_RBIAS: R107.2 U14.64(RBIAS)
USB5734T_RST: U14.48(RESET_N) ; port USB5734T_RST
VBUS_USB5734T: U14.41(VBUS_DET/GPIO16) U15.1(OUT)
VDD12_1: C112.2 C114.2 C116.2 C119.2 C125.2 C128.2 C129.2 C130.2 C131.2 FB3.2 U14.6(VDD12) U14.13(VDD12) U14.17(VDD12) U14.23(VDD12) U14.30(VDD12) U14.35(VDD12) U14.51(VDD12) U14.57(VDD12)
VDD33_1: C113.2 C115.2 C117.2 C120.2 C126.2 FB4.2 U14.18(VDD33) U14.33(VDD33) U14.52(VDD33) U14.63(VDD33)
NetC127_2: C127.2 R104.1 X2.1
NetD14_1: D14.1 D14.3 R109.1
NetD15_1: D15.1 D15.3 R110.1
NetD16_1: D16.1 D16.3 R111.1
NetD17_1: D17.1 D17.3 R112.1
NetR108_1: R108.1 U15.3(FLG)

Not connected (* = marked no-connect by the designer): U14 16(PROG_FUNC7)*

### Layout directives
differential pair; differential pair class DIFF_USB_90Ω: USB2P3_N, USB2P3_P, USB3RX0_N, USB3RX0_P, USB3RX3_N, USB3RX3_P, USB3TX0_N, USB3TX0_P, USB3TX3_N, USB3TX3_P

### Notes on the sheet
- DEC CAPACITOR
- VBUS_DET
- CONNECTION LED
- PORTA 1
- PORTA 2
- Blue = USB 3.2
  Yellow = USB 2.0
- PORTA 3
- PORTA 4
- Posizionare i Condensatore vicino al trasmettitore
- (near R100) Imposto il Chip in SMBus Slave
- (near R103) All Ports Are Removable
- (near R99) I2C ADDRESS: 0x2D
- Ports 1, 2, 3, 4 DCP enabled
- (in symbol AP22815AWT-7) AP22815; Singel Channel; Current Limited
- (in symbol Title) TITLE; DATE; REVISION; DRAWN BY; PAGE; OF
- (in symbol USB5734T/MR) UPSTREAM PORT USB3; DOWNSTREAM PORT 1 USB3; DOWNSTREAM PORT 2 USB3; DOWNSTREAM PORT 3 USB3; DOWNSTREAM PORT 4 USB3

### Library data of the parts
C112 C113 C132 = CAP_0603: Capacitor SMD 0603 [C15849]; Manufacturer: *; Manufacturer Part Number: *; Distributor Link: *; LCSC: *; Rating: *; Dielectric: *
C114-C117 C119 C120 C125 C126 C128-C131 = CAP_0603: Capacitor SMD 0603 [C14663]; Manufacturer: *; Manufacturer Part Number: *; Distributor Link: *; LCSC: *; Rating: *; Dielectric: *
C118 C127 = CAP_0402: Capacitor SMD 0402 [C1549]; Manufacturer: *; Manufacturer Part Number: *; Distributor Link: *; LCSC: *; Rating: *; Dielectric: *
C121-C124 = CAP_0402: Capacitor SMD 0402[C1525]; Manufacturer: *; Manufacturer Part Number: *; Distributor Link: *; LCSC: *; Rating: *; Dielectric: *
D14-D17 = A-SP1962Y3B1C-C01-3T: [C19171299]
FB3 FB4 = FB_0603: Ferrite Bead SMD 0603[C76892]; Manufacturer: *; Manufacturer Part Number: *; Distributor Link: *; LCSC: *
R98-R100 R102 R105 = RES_0603: Resistor SMD 0603[C25804]; Manufacturer: *; Manufacturer Part Number: *; Distributor Link: *; LCSC: *
R101 = RES_0603: Resistor SMD 0603[C22859]; Manufacturer: *; Manufacturer Part Number: *; Distributor Link: *; LCSC: *
R103 = RES_0603: Resistor SMD 0603[C25811]; Manufacturer: *; Manufacturer Part Number: *; Distributor Link: *; LCSC: *
R104 = RES_0402: Resistor SMD 0402 [C17168]; Manufacturer: *; Manufacturer Part Number: *; Distributor Link: *; LCSC: *
R106 = RES_0603: [C21190]; Manufacturer: *; Manufacturer Part Number: *; Distributor Link: *; LCSC: *
R107 = RES_0603: [C22790]; Manufacturer: *; Manufacturer Part Number: *; Distributor Link: *; LCSC: *
R108 = RES_0603: [C25804]; Manufacturer: *; Manufacturer Part Number: *; Distributor Link: *; LCSC: *
R109-R112 = RES_0603: [C23204]; Manufacturer: *; Manufacturer Part Number: *; Distributor Link: *; LCSC: *
U14 = USB5734T/MR: [C626710]
U15 = AP22815AWT-7: [C2150007]
X2 = TSX-3225_24.0000MF15X-AC: Crystal SMD 24MHz 10PPM 7pF 3225 [C9006]; Manufacturer: Epson; Manufacturer Part Number: TSX-3225 24.0000MF15X-AC

## Sheet USB_HUB2 DN PORT.SchDoc: USB_HUB 3.0
size A2; DrawnBy: Luca Schenetti; Revision: A; SheetNumber: 8; SheetTotal: 10
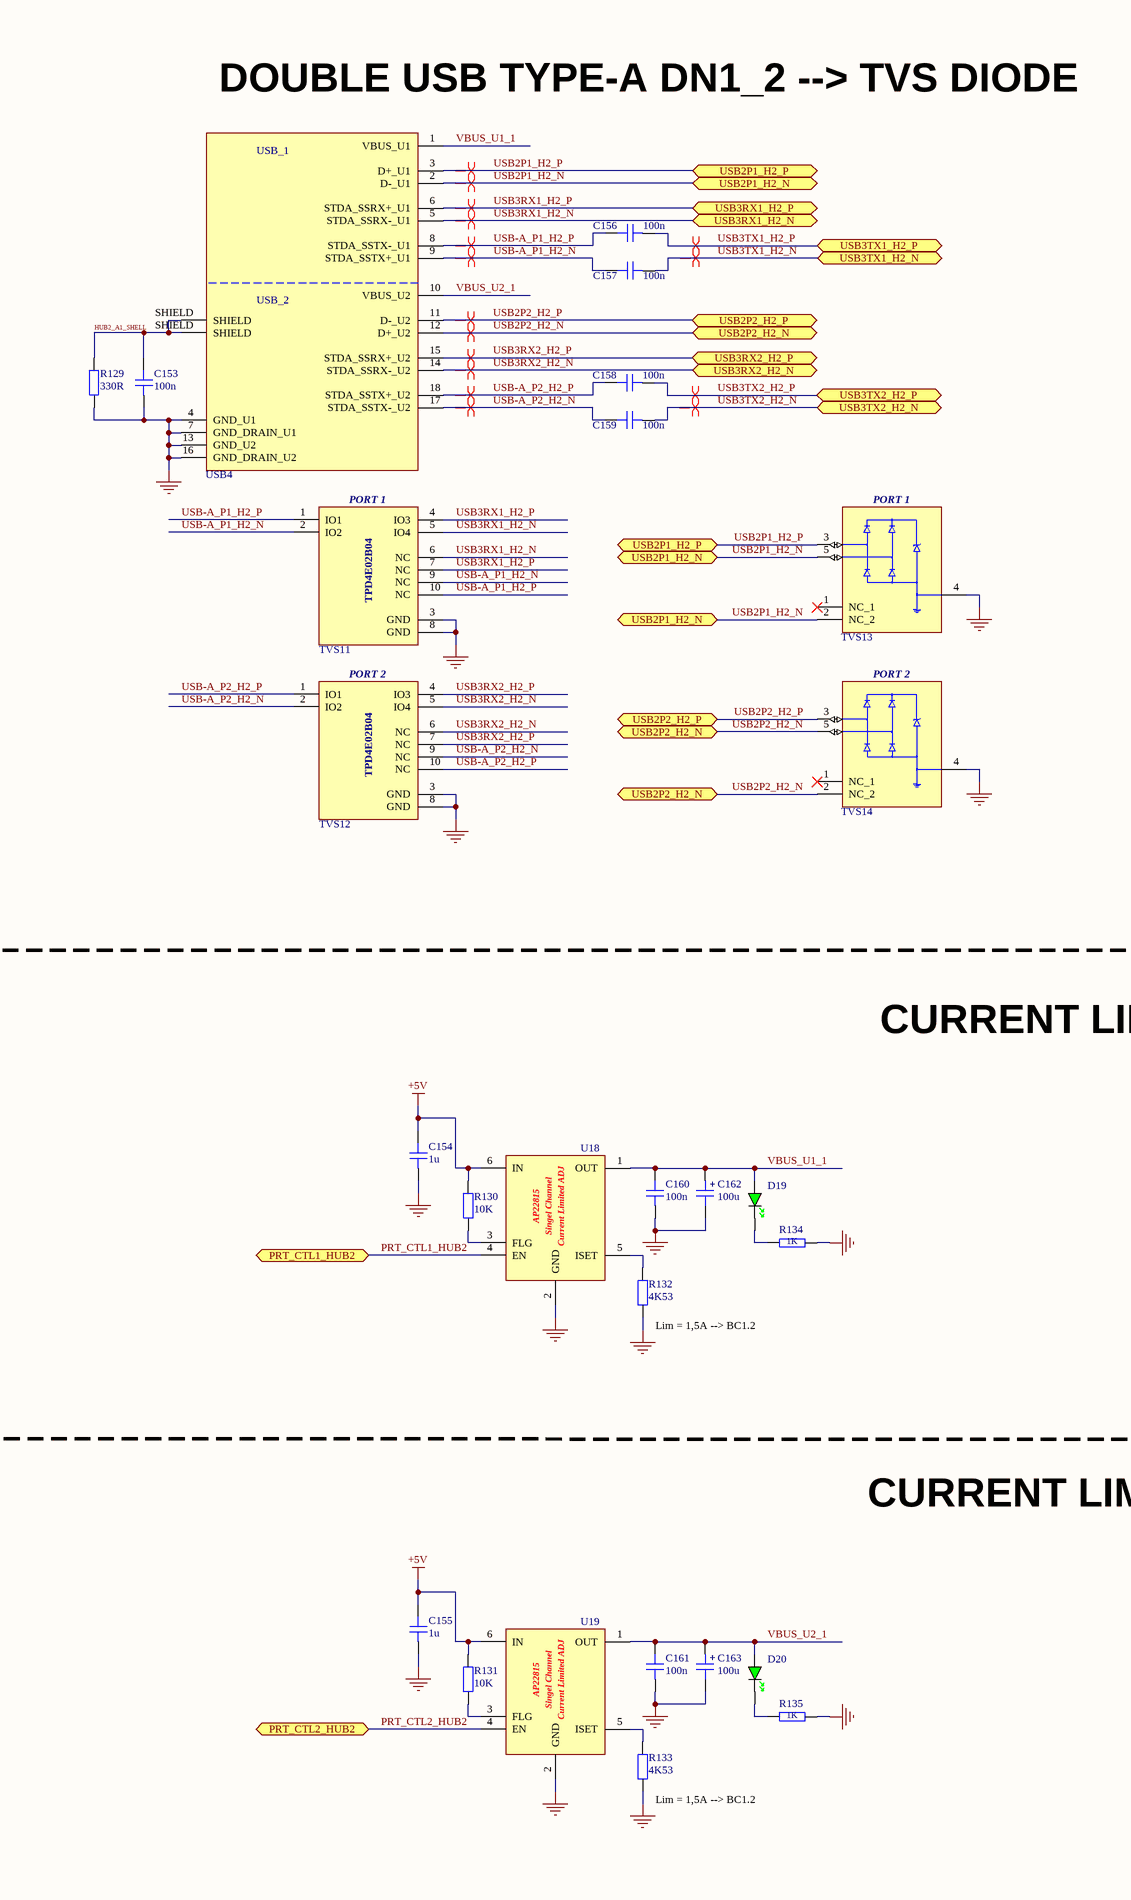
[diagram p13: USB_HUB2 DN PORT.SchDoc, left]
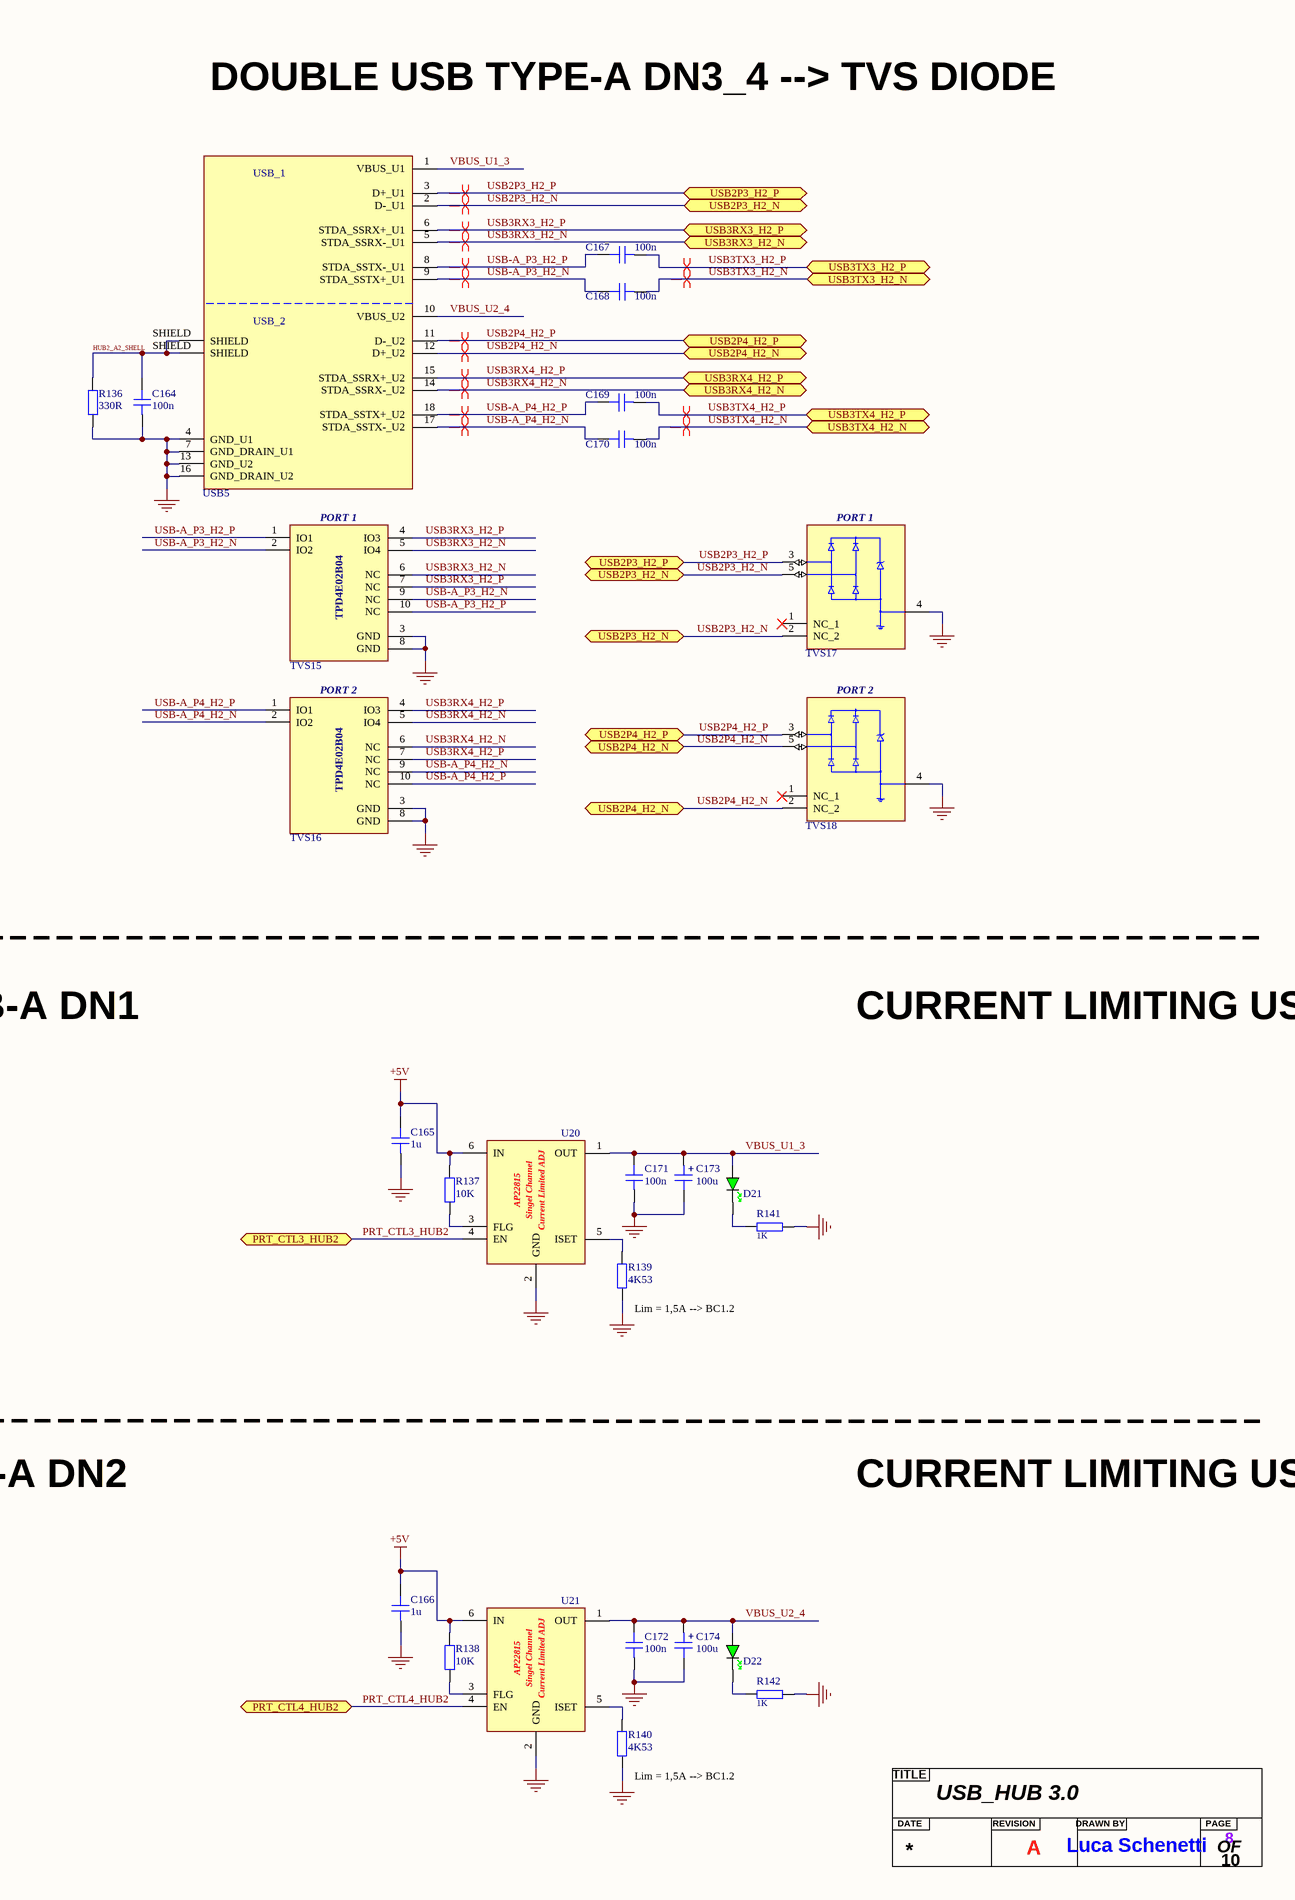
[diagram p14: USB_HUB2 DN PORT.SchDoc, right]

### Parts
(Parts that share a designator on the sheet are numbered #1, #2 ... from top to bottom, then left to right.)
?#8  Title  (value not drawn)  (graphical)
C153  100n  [CAP_0603]
C154  1u  [CAP_0603]
C155  1u  [CAP_0603]
C156  100n  [CAP_0402]
C157  100n  [CAP_0402]
C158  100n  [CAP_0402]
C159  100n  [CAP_0402]
C160  100n  [CAP_0603]
C161  100n  [CAP_0603]
C162  100u  [CAP_AE_SMD_D6MM3_H5M55]
C163  100u  [CAP_AE_SMD_D6MM3_H5M55]
C164  100n  [CAP_0603]
C165  1u  [CAP_0603]
C166  1u  [CAP_0603]
C167  100n  [CAP_0402]
C168  100n  [CAP_0402]
C169  100n  [CAP_0402]
C170  100n  [CAP_0402]
C171  100n  [CAP_0603]
C172  100n  [CAP_0603]
C173  100u  [CAP_AE_SMD_D6MM3_H5M55]
C174  100u  [CAP_AE_SMD_D6MM3_H5M55]
D19  GREEN  [LED_0603_GREEN]  (value not drawn)
D20  GREEN  [LED_0603_GREEN]  (value not drawn)
D21  GREEN  [LED_0603_GREEN]  (value not drawn)
D22  GREEN  [LED_0603_GREEN]  (value not drawn)
R129  330R  [RES_0603]
R130  10K  [RES_0603]
R131  10K  [RES_0603]
R132  4K53  [RES_0603]
R133  4K53  [RES_0603]
R134  1K  [RES_0603]
R135  1K  [RES_0603]
R136  330R  [RES_0603]
R137  10K  [RES_0603]
R138  10K  [RES_0603]
R139  4K53  [RES_0603]
R140  4K53  [RES_0603]
R141  1K  [RES_0603]
R142  1K  [RES_0603]
TVS11  TVS DIODE USB 3  [TPD4E02B04DQAR]  (value not drawn)
TVS12  TVS DIODE USB 3  [TPD4E02B04DQAR]  (value not drawn)
TVS13  TVS USB 2.0 ±25-kV  [TPD2E2U06DRLR]  (value not drawn)
TVS14  TVS USB 2.0 ±25-kV  [TPD2E2U06DRLR]  (value not drawn)
TVS15  TVS DIODE USB 3  [TPD4E02B04DQAR]  (value not drawn)
TVS16  TVS DIODE USB 3  [TPD4E02B04DQAR]  (value not drawn)
TVS17  TVS USB 2.0 ±25-kV  [TPD2E2U06DRLR]  (value not drawn)
TVS18  TVS USB 2.0 ±25-kV  [TPD2E2U06DRLR]  (value not drawn)
U18  Single-Channel, Current-Limited,ISET  [AP22615AWU-7]  (value not drawn)
U19  Single-Channel, Current-Limited,ISET  [AP22615AWU-7]  (value not drawn)
U20  Single-Channel, Current-Limited,ISET  [AP22615AWU-7]  (value not drawn)
U21  Single-Channel, Current-Limited,ISET  [AP22615AWU-7]  (value not drawn)
USB4  DOUBLE TYPE-A 3.0  [ZX-TYPEA-3-WCM99]  (value not drawn)
USB5  DOUBLE TYPE-A 3.0  [ZX-TYPEA-3-WCM99]  (value not drawn)

### Ports
PRT_CTL1_HUB2 (bidir, see USB_HUB1 DN PORT 3[2C]), PRT_CTL2_HUB2 (bidir, see USB_HUB1 DN PORT 3[2C]), PRT_CTL3_HUB2 (bidir, see USB_HUB1 DN PORT 3[2C]), PRT_CTL4_HUB2 (bidir, see USB_HUB1 DN PORT 3[2C]), USB2P1_H2_N (bidir, see USB_HUB1 DN PORT 3[4B], USB_HUB2 DN PORT[3A], USB_HUB2 DN PORT[3B]), USB2P1_H2_N (bidir, see USB_HUB1 DN PORT 3[4B], USB_HUB2 DN PORT[3B]), USB2P1_H2_P (bidir, see USB_HUB1 DN PORT 3[4B], USB_HUB2 DN PORT[3A]), USB2P1_H2_P (bidir, see USB_HUB1 DN PORT 3[4B], USB_HUB2 DN PORT[3B]), USB2P2_H2_N (bidir, see USB_HUB1 DN PORT 3[4C], USB_HUB2 DN PORT[3A], USB_HUB2 DN PORT[3B]), USB2P2_H2_N (bidir, see USB_HUB1 DN PORT 3[4C], USB_HUB2 DN PORT[3B]), USB2P2_H2_P (bidir, see USB_HUB1 DN PORT 3[4C], USB_HUB2 DN PORT[3A]), USB2P2_H2_P (bidir, see USB_HUB1 DN PORT 3[4C], USB_HUB2 DN PORT[3B]), USB2P3_H2_N (bidir, see USB_HUB1 DN PORT 3[4C], USB_HUB2 DN PORT[6B]), USB2P3_H2_N (bidir, see USB_HUB1 DN PORT 3[4C], USB_HUB2 DN PORT[6B], USB_HUB2 DN PORT[7A]), USB2P3_H2_P (bidir, see USB_HUB1 DN PORT 3[4C], USB_HUB2 DN PORT[6B]), USB2P3_H2_P (bidir, see USB_HUB1 DN PORT 3[4C], USB_HUB2 DN PORT[7A]), USB2P4_H2_N (bidir, see USB_HUB1 DN PORT 3[4C], USB_HUB2 DN PORT[6B]), USB2P4_H2_N (bidir, see USB_HUB1 DN PORT 3[4C], USB_HUB2 DN PORT[6B], USB_HUB2 DN PORT[7A]), USB2P4_H2_P (bidir, see USB_HUB1 DN PORT 3[4C], USB_HUB2 DN PORT[6B]), USB2P4_H2_P (bidir, see USB_HUB1 DN PORT 3[4C], USB_HUB2 DN PORT[7A]), USB3RX1_H2_N (bidir, see USB_HUB1 DN PORT 3[4B]), USB3RX1_H2_P (bidir, see USB_HUB1 DN PORT 3[4B]), USB3RX2_H2_N (bidir, see USB_HUB1 DN PORT 3[4C]), USB3RX2_H2_P (bidir, see USB_HUB1 DN PORT 3[4C]), USB3RX3_H2_N (bidir, see USB_HUB1 DN PORT 3[4C]), USB3RX3_H2_P (bidir, see USB_HUB1 DN PORT 3[4C]), USB3RX4_H2_N (bidir, see USB_HUB1 DN PORT 3[4C]), USB3RX4_H2_P (bidir, see USB_HUB1 DN PORT 3[4C]), USB3TX1_H2_N (bidir, see USB_HUB1 DN PORT 3[4C]), USB3TX1_H2_P (bidir, see USB_HUB1 DN PORT 3[4C]), USB3TX2_H2_N (bidir, see USB_HUB1 DN PORT 3[4C]), USB3TX2_H2_P (bidir, see USB_HUB1 DN PORT 3[4C]), USB3TX3_H2_N (bidir, see USB_HUB1 DN PORT 3[4C]), USB3TX3_H2_P (bidir, see USB_HUB1 DN PORT 3[4C]), USB3TX4_H2_N (bidir, see USB_HUB1 DN PORT 3[4C]), USB3TX4_H2_P (bidir, see USB_HUB1 DN PORT 3[4C])

### Nets
+5V: C154.2 C155.2 C165.2 C166.2 R130.2 R131.2 R137.2 R138.2 U18.6(IN) U19.6(IN) U20.6(IN) U21.6(IN)
GND: C153.1 C154.1 C155.1 C160.1 C161.1 C162.2 C163.2 C164.1 C165.1 C166.1 C171.1 C172.1 C173.2 C174.2 R129.1 R132.1 R133.1 R134.2 R135.2 R136.1 R139.1 R140.1 R141.2 R142.2 TVS11.3(GND) TVS11.8(GND) TVS12.3(GND) TVS12.8(GND) TVS13.4(GND) TVS14.4(GND) TVS15.3(GND) TVS15.8(GND) TVS16.3(GND) TVS16.8(GND) TVS17.4(GND) TVS18.4(GND) U18.2(GND) U19.2(GND) U20.2(GND) U21.2(GND) USB4.4(GND_U1) USB4.7(GND_DRAIN_U1) USB4.13(GND_U2) USB4.16(GND_DRAIN_U2) USB5.4(GND_U1) USB5.7(GND_DRAIN_U1) USB5.13(GND_U2) USB5.16(GND_DRAIN_U2)
HUB2_A1_SHELL: C153.2 R129.2 USB4.SHIELD
HUB2_A2_SHELL: C164.2 R136.2 USB5.SHIELD
PRT_CTL1_HUB2: U18.4(EN) ; port PRT_CTL1_HUB2
PRT_CTL2_HUB2: U19.4(EN) ; port PRT_CTL2_HUB2
PRT_CTL3_HUB2: U20.4(EN) ; port PRT_CTL3_HUB2
PRT_CTL4_HUB2: U21.4(EN) ; port PRT_CTL4_HUB2
USB2P1_H2_N: TVS13.2(NC_2) TVS13.5(IO2) USB4.2(D-_U1) ; port USB2P1_H2_N
USB2P1_H2_P: TVS13.3(IO1) USB4.3(D+_U1) ; port USB2P1_H2_P
USB2P2_H2_N: TVS14.2(NC_2) TVS14.5(IO2) USB4.12(D+_U2) ; port USB2P2_H2_N
USB2P2_H2_P: TVS14.3(IO1) USB4.11(D-_U2) ; port USB2P2_H2_P
USB2P3_H2_N: TVS17.2(NC_2) TVS17.5(IO2) USB5.2(D-_U1) ; port USB2P3_H2_N
USB2P3_H2_P: TVS17.3(IO1) USB5.3(D+_U1) ; port USB2P3_H2_P
USB2P4_H2_N: TVS18.2(NC_2) TVS18.5(IO2) USB5.12(D+_U2) ; port USB2P4_H2_N
USB2P4_H2_P: TVS18.3(IO1) USB5.11(D-_U2) ; port USB2P4_H2_P
USB3RX1_H2_N: TVS11.5(IO4) TVS11.6(NC) USB4.5(STDA_SSRX-_U1) ; port USB3RX1_H2_N
USB3RX1_H2_P: TVS11.4(IO3) TVS11.7(NC) USB4.6(STDA_SSRX+_U1) ; port USB3RX1_H2_P
USB3RX2_H2_N: TVS12.5(IO4) TVS12.6(NC) USB4.14(STDA_SSRX-_U2) ; port USB3RX2_H2_N
USB3RX2_H2_P: TVS12.4(IO3) TVS12.7(NC) USB4.15(STDA_SSRX+_U2) ; port USB3RX2_H2_P
USB3RX3_H2_N: TVS15.5(IO4) TVS15.6(NC) USB5.5(STDA_SSRX-_U1) ; port USB3RX3_H2_N
USB3RX3_H2_P: TVS15.4(IO3) TVS15.7(NC) USB5.6(STDA_SSRX+_U1) ; port USB3RX3_H2_P
USB3RX4_H2_N: TVS16.5(IO4) TVS16.6(NC) USB5.14(STDA_SSRX-_U2) ; port USB3RX4_H2_N
USB3RX4_H2_P: TVS16.4(IO3) TVS16.7(NC) USB5.15(STDA_SSRX+_U2) ; port USB3RX4_H2_P
USB3TX1_H2_N: C157.1 ; port USB3TX1_H2_N
USB3TX1_H2_P: C156.1 ; port USB3TX1_H2_P
USB3TX2_H2_N: C159.1 ; port USB3TX2_H2_N
USB3TX2_H2_P: C158.1 ; port USB3TX2_H2_P
USB3TX3_H2_N: C168.1 ; port USB3TX3_H2_N
USB3TX3_H2_P: C167.1 ; port USB3TX3_H2_P
USB3TX4_H2_N: C170.1 ; port USB3TX4_H2_N
USB3TX4_H2_P: C169.1 ; port USB3TX4_H2_P
USB-A_P1_H2_N: C157.2 TVS11.2(IO2) TVS11.9(NC) USB4.9(STDA_SSTX+_U1)
USB-A_P1_H2_P: C156.2 TVS11.1(IO1) TVS11.10(NC) USB4.8(STDA_SSTX-_U1)
USB-A_P2_H2_N: C159.2 TVS12.2(IO2) TVS12.9(NC) USB4.17(STDA_SSTX-_U2)
USB-A_P2_H2_P: C158.2 TVS12.1(IO1) TVS12.10(NC) USB4.18(STDA_SSTX+_U2)
USB-A_P3_H2_N: C168.2 TVS15.2(IO2) TVS15.9(NC) USB5.9(STDA_SSTX+_U1)
USB-A_P3_H2_P: C167.2 TVS15.1(IO1) TVS15.10(NC) USB5.8(STDA_SSTX-_U1)
USB-A_P4_H2_N: C170.2 TVS16.2(IO2) TVS16.9(NC) USB5.17(STDA_SSTX-_U2)
USB-A_P4_H2_P: C169.2 TVS16.1(IO1) TVS16.10(NC) USB5.18(STDA_SSTX+_U2)
VBUS_U1_1: C160.2 C162.1 D19.A U18.1(OUT) USB4.1(VBUS_U1)
VBUS_U1_3: C171.2 C173.1 D21.A U20.1(OUT) USB5.1(VBUS_U1)
VBUS_U2_1: C161.2 C163.1 D20.A U19.1(OUT) USB4.10(VBUS_U2)
VBUS_U2_4: C172.2 C174.1 D22.A U21.1(OUT) USB5.10(VBUS_U2)
NetD19_K: D19.K R134.1
NetD20_K: D20.K R135.1
NetD21_K: D21.K R141.1
NetD22_K: D22.K R142.1
NetR130_1: R130.1 U18.3(FLG)
NetR131_1: R131.1 U19.3(FLG)
NetR132_2: R132.2 U18.5(ISET)
NetR133_2: R133.2 U19.5(ISET)
NetR137_1: R137.1 U20.3(FLG)
NetR138_1: R138.1 U21.3(FLG)
NetR139_2: R139.2 U20.5(ISET)
NetR140_2: R140.2 U21.5(ISET)

Not connected (* = marked no-connect by the designer): TVS13 1(NC_1)*; TVS14 1(NC_1)*; TVS17 1(NC_1)*; TVS18 1(NC_1)*

### Layout directives
differential pair; differential pair class DIFF_USB_90Ω: USB2P1_H2_N, USB2P1_H2_P, USB2P2_H2_N, USB2P2_H2_P, USB2P3_H2_N, USB2P3_H2_P, USB2P4_H2_N, USB2P4_H2_P, USB3RX1_H2_N, USB3RX1_H2_P, USB3RX2_H2_N, USB3RX2_H2_P, USB3RX3_H2_N, USB3RX3_H2_P, USB3RX4_H2_N, USB3RX4_H2_P, USB3TX1_H2_N, USB3TX1_H2_P, USB3TX2_H2_N, USB3TX2_H2_P, USB3TX3_H2_N, USB3TX3_H2_P, USB3TX4_H2_N, USB3TX4_H2_P, USB-A_P1_H2_N, USB-A_P1_H2_P, USB-A_P2_H2_N, USB-A_P2_H2_P, USB-A_P3_H2_N, USB-A_P3_H2_P, USB-A_P4_H2_N, USB-A_P4_H2_P

### Notes on the sheet
- (near USB4) DOUBLE USB TYPE-A DN1_2 --> TVS DIODE
- DOUBLE USB TYPE-A DN3_4 --> TVS DIODE
- (near TVS11) PORT 1
- (near TVS13) PORT 1
- (near TVS15) PORT 1
- (near TVS17) PORT 1
- (near TVS12) PORT 2
- PORT 2
- (near TVS16) PORT 2
- CURRENT LIMITING USB-A DN1
- CURRENT LIMITING USB-A DN3
- (near R132) Lim = 1,5A --> BC1.2
- (near R139) Lim = 1,5A --> BC1.2
- CURRENT LIMITING USB-A DN2
- CURRENT LIMITING USB-A DN4
- (near R133) Lim = 1,5A --> BC1.2
- (near R140) Lim = 1,5A --> BC1.2
- (in symbol AP22615AWU-7) AP22815; Singel Channel; Current Limited ADJ
- (in symbol CAP_ALEL_6.3x5.5) +
- (in symbol Title) TITLE; DATE; REVISION; DRAWN BY; PAGE; OF
- (in symbol TPD4E02B04DQAR) TPD4E02B04
- (in symbol ZX-TYPEA-3-WCM99) USB_1; USB_2

### Library data of the parts
C153 C160 C161 C164 C171 C172 = CAP_0603: Capacitor SMD 0603 [C14663]; Manufacturer: *; Manufacturer Part Number: *; Distributor Link: *; LCSC: *; Rating: *; Dielectric: *
C154 C155 C165 C166 = CAP_0603: Capacitor SMD 0603 [C15849]; Manufacturer: *; Manufacturer Part Number: *; Distributor Link: *; LCSC: *; Rating: *; Dielectric: *
C156-C159 C167-C170 = CAP_0402: Capacitor SMD 0402[C1525]; Manufacturer: *; Manufacturer Part Number: *; Distributor Link: *; LCSC: *; Rating: *; Dielectric: *
C162 C163 C173 C174 = CAP_ALEL_6.3x5.5: [C59936]; Manufacturer: *; Manufacturer Part Number: *; Distributor Link: *; LCSC: *
D19-D22 = LED_0603_GREEN: [C2986059]
R129 R136 = RES_0603: [C23138]; Manufacturer: *; Manufacturer Part Number: *; Distributor Link: *; LCSC: *
R130 R131 R137 R138 = RES_0603: [C25804]; Manufacturer: *; Manufacturer Part Number: *; Distributor Link: *; LCSC: *
R132 R133 R139 R140 = RES_0603: [C25971]; Manufacturer: *; Manufacturer Part Number: *; Distributor Link: *; LCSC: *
R134 R135 R141 R142 = RES_0603: [C21190]; Manufacturer: *; Manufacturer Part Number: *; Distributor Link: *; LCSC: *
TVS11 TVS12 TVS15 TVS16 = TPD4E02B04DQAR: [C106794]
TVS13 TVS14 TVS17 TVS18 = TPD2E2U06DRLR: [C1972959]
U18-U21 = AP22615AWU-7: [C2680357]
USB4 USB5 = ZX-TYPEA-3-WCM99: [C7419883]

## Sheet USB_HUB1 DN PORT 4.SchDoc: USB_HUB 3.0
size A3; DrawnBy: Luca Schenetti; Revision: A; SheetNumber: 9; SheetTotal: 10
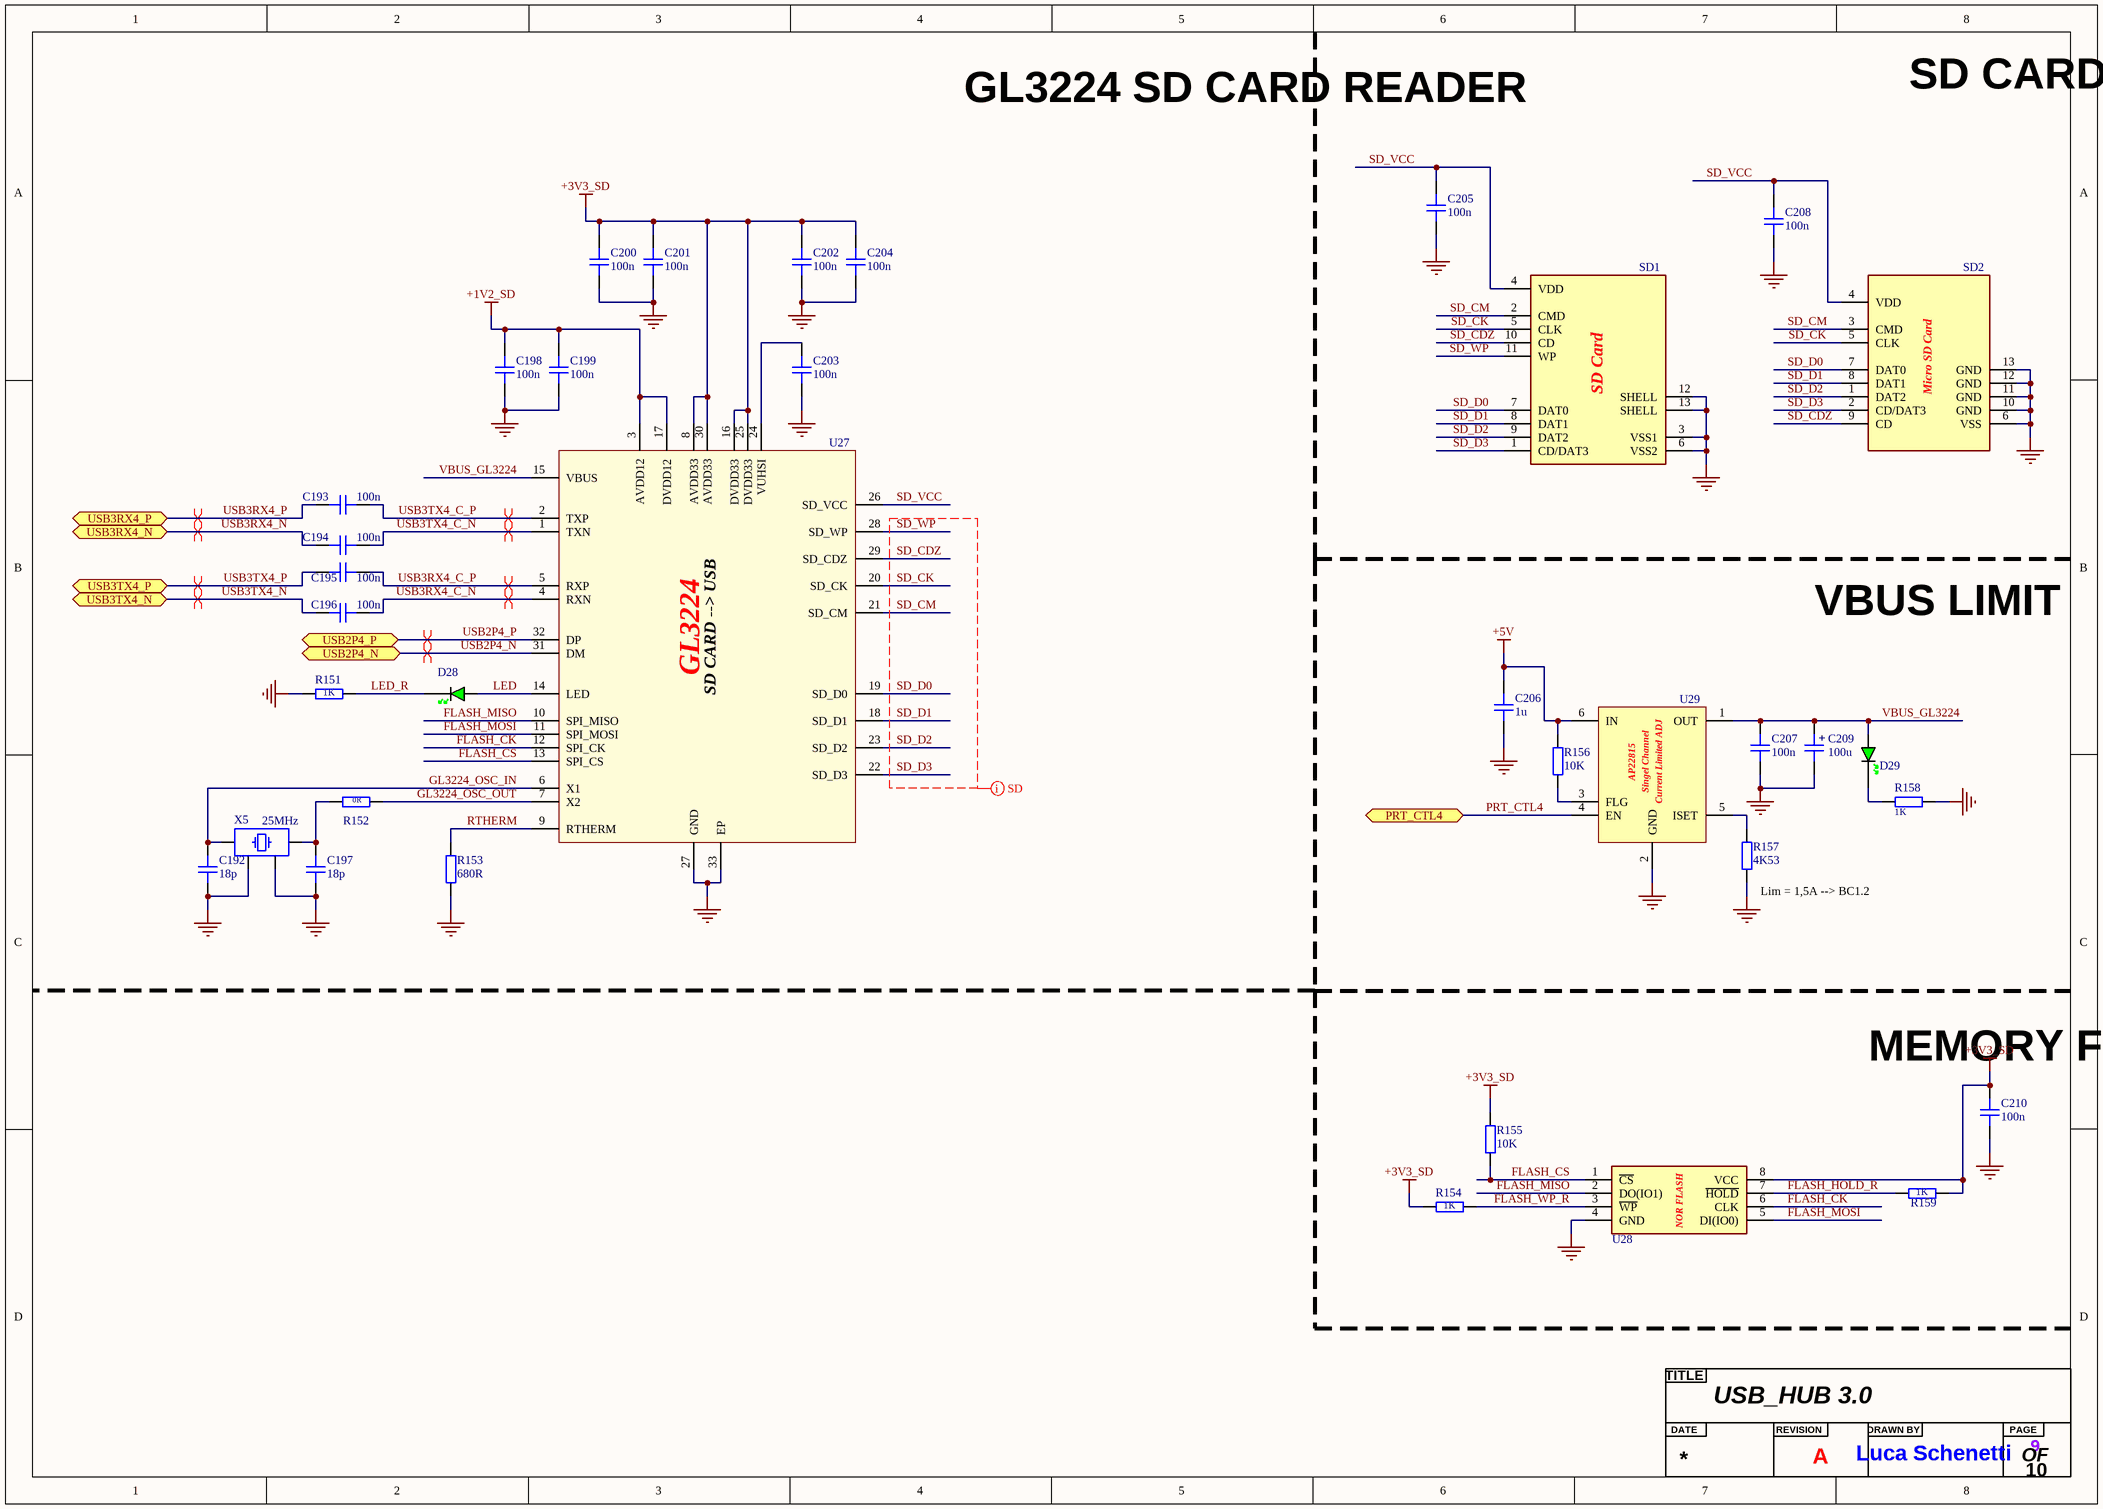
[diagram p15: USB_HUB1 DN PORT 4.SchDoc]

### Parts
(Parts that share a designator on the sheet are numbered #1, #2 ... from top to bottom, then left to right.)
?#9  Title  (value not drawn)  (graphical)
C192  18p  [CAP_0402]
C193  100n  [CAP_0402]
C194  100n  [CAP_0402]
C195  100n  [CAP_0402]
C196  100n  [CAP_0402]
C197  18p  [CAP_0402]
C198  100n  [CAP_0603]
C199  100n  [CAP_0603]
C200  100n  [CAP_0603]
C201  100n  [CAP_0603]
C202  100n  [CAP_0603]
C203  100n  [CAP_0603]
C204  100n  [CAP_0603]
C205  100n  [CAP_0603]
C206  1u  [CAP_0603]
C207  100n  [CAP_0603]
C208  100n  [CAP_0603]
C209  100u  [CAP_AE_SMD_D6MM3_H5M55]
C210  100n  [CAP_0603]
D28  GREEN  [LED_0603_GREEN]  (value not drawn)
D29  GREEN  [LED_0603_GREEN]  (value not drawn)
R151  1K  [RES_0603]
R152  0R  [RES_0402]
R153  680R  [RES_0603]
R154  1K  [RES_0603]
R155  10K  [RES_0603]
R156  10K  [RES_0603]
R157  4K53  [RES_0603]
R158  1K  [RES_0603]
R159  1K  [RES_0603]
SD1  Standard SD Card  [SD-106M]  (value not drawn)
SD2  Micro SD Card  [TF-01A]  (value not drawn)
U27  SD CARD TO USB 3.1  [GL3224-OIY04]  (value not drawn)
U28  NOR FLASH 2M-bit/256K-byte  [W25X20CLSNIG]  (value not drawn)
U29  Single-Channel, Current-Limited,ISET  [AP22615AWU-7]  (value not drawn)
X5  25MHz  [XTAL_3225]

### Ports
PRT_CTL4 (bidir, see USB_HUB1[6D]), USB2P4_N (bidir, see USB_HUB1[6C]), USB2P4_P (bidir, see USB_HUB1[6C]), USB3RX4_N (bidir, see USB_HUB1[6C]), USB3RX4_P (bidir, see USB_HUB1[6C]), USB3TX4_N (bidir, see USB_HUB1[6D]), USB3TX4_P (bidir, see USB_HUB1[6D])

### Nets
+1V2_SD: C198.2 C199.2 U27.3(AVDD12) U27.17(DVDD12)
+3V3_SD: C200.2 C201.2 C202.2 C204.2 C210.2 R154.2 R155.2 R159.1 U27.8(AVDD33) U27.16(DVDD33) U27.25(DVDD33) U27.30(AVDD33) U28.8(VCC)
+5V: C206.2 R156.2 U29.6(IN)
GND: C192.1 C197.1 C198.1 C199.1 C200.1 C201.1 C202.1 C203.1 C204.1 C205.1 C206.1 C207.1 C208.1 C209.2 C210.1 R151.2 R153.1 R157.1 R158.2 SD1.3(VSS1) SD1.6(VSS2) SD1.12(SHELL) SD1.13(SHELL) SD2.6(VSS) SD2.10(GND) SD2.11(GND) SD2.12(GND) SD2.13(GND) U27.27(GND) U27.33(EP) U28.4(GND) U29.2(GND) X5.2 X5.4
FLASH_CK: U27.12(SPI_CK) U28.6(CLK)
FLASH_CS: R155.1 U27.13(SPI_CS) U28.1(~{CS})
FLASH_HOLD_R: R159.2 U28.7(~{HOLD})
FLASH_MISO: U27.10(SPI_MISO) U28.2(DO(IO1))
FLASH_MOSI: U27.11(SPI_MOSI) U28.5(DI(IO0))
FLASH_WP_R: R154.1 U28.3(~{WP})
GL3224_OSC_IN: C192.2 U27.6(X1) X5.3
GL3224_OSC_OUT: R152.2 U27.7(X2)
LED: D28.A U27.14(LED)
LED_R: D28.K R151.1
PRT_CTL4: U29.4(EN) ; port PRT_CTL4
RTHERM: R153.2 U27.9(RTHERM)
SD_CDZ: SD1.10(CD) SD2.9(CD) U27.29(SD_CDZ)
SD_CK: SD1.5(CLK) SD2.5(CLK) U27.20(SD_CK)
SD_CM: SD1.2(CMD) SD2.3(CMD) U27.21(SD_CM)
SD_D0: SD1.7(DAT0) SD2.7(DAT0) U27.19(SD_D0)
SD_D1: SD1.8(DAT1) SD2.8(DAT1) U27.18(SD_D1)
SD_D2: SD1.9(DAT2) SD2.1(DAT2) U27.23(SD_D2)
SD_D3: SD1.1(CD/DAT3) SD2.2(CD/DAT3) U27.22(SD_D3)
SD_VCC: C205.2 C208.2 SD1.4(VDD) SD2.4(VDD) U27.26(SD_VCC)
SD_WP: SD1.11(WP) U27.28(SD_WP)
USB2P4_N: U27.31(DM) ; port USB2P4_N
USB2P4_P: U27.32(DP) ; port USB2P4_P
USB3RX4_C_N: C196.1 U27.4(RXN)
USB3RX4_C_P: C195.1 U27.5(RXP)
USB3RX4_N: C194.2 ; port USB3RX4_N
USB3RX4_P: C193.2 ; port USB3RX4_P
USB3TX4_C_N: C194.1 U27.1(TXN)
USB3TX4_C_P: C193.1 U27.2(TXP)
USB3TX4_N: C196.2 ; port USB3TX4_N
USB3TX4_P: C195.2 ; port USB3TX4_P
VBUS_GL3224: C207.2 C209.1 D29.A U27.15(VBUS) U29.1(OUT)
NetC197_2: C197.2 R152.1 X5.1
NetC203_2: C203.2 U27.24(VUHSI)
NetD29_K: D29.K R158.1
NetR156_1: R156.1 U29.3(FLG)
NetR157_2: R157.2 U29.5(ISET)

### Layout directives
net class SD; rule Matched Net Lengths [Delay Tolerance = 100ps]: SD_CDZ, SD_CK, SD_CM, SD_D0, SD_D1, SD_D2, SD_D3, SD_WP
differential pair; differential pair class DIFF_USB_90Ω: USB2P4_N, USB2P4_P, USB3RX4_C_N, USB3RX4_C_P, USB3RX4_N, USB3RX4_P, USB3TX4_C_N, USB3TX4_C_P, USB3TX4_N, USB3TX4_P

### Notes on the sheet
- GL3224 SD CARD READER
- SD CARD CONNECTOR
- VBUS LIMIT
- (near R157) Lim = 1,5A --> BC1.2
- MEMORY FLASH
- (in symbol AP22615AWU-7) AP22815; Singel Channel; Current Limited ADJ
- (in symbol CAP_ALEL_6.3x5.5) +
- (in symbol GL3224-OIY04) GL3224; SD CARD --> USB
- (in symbol SD-106M) SD Card
- (in symbol Title) TITLE; DATE; REVISION; DRAWN BY; PAGE; OF
- (in symbol W25X20CLSNIG) NOR FLASH

### Library data of the parts
C192 C197 = CAP_0402: Capacitor SMD 0402 [C1549]; Manufacturer: *; Manufacturer Part Number: *; Distributor Link: *; LCSC: *; Rating: *; Dielectric: *
C193-C196 = CAP_0402: Capacitor SMD 0402[C1525]; Manufacturer: *; Manufacturer Part Number: *; Distributor Link: *; LCSC: *; Rating: *; Dielectric: *
C198-C205 C207 C208 C210 = CAP_0603: Capacitor SMD 0603 [C14663]; Manufacturer: *; Manufacturer Part Number: *; Distributor Link: *; LCSC: *; Rating: *; Dielectric: *
C206 = CAP_0603: Capacitor SMD 0603 [C15849]; Manufacturer: *; Manufacturer Part Number: *; Distributor Link: *; LCSC: *; Rating: *; Dielectric: *
C209 = CAP_ALEL_6.3x5.5: [C59936]; Manufacturer: *; Manufacturer Part Number: *; Distributor Link: *; LCSC: *
D28 D29 = LED_0603_GREEN: [C2986059]
R151 R154 R158 R159 = RES_0603: [C21190]; Manufacturer: *; Manufacturer Part Number: *; Distributor Link: *; LCSC: *
R152 = RES_0402: Resistor SMD 0402 [C17168]; Manufacturer: *; Manufacturer Part Number: *; Distributor Link: *; LCSC: *
R153 = RES_0603: [C23228]; Manufacturer: *; Manufacturer Part Number: *; Distributor Link: *; LCSC: *
R155 R156 = RES_0603: [C25804]; Manufacturer: *; Manufacturer Part Number: *; Distributor Link: *; LCSC: *
R157 = RES_0603: [C25971]; Manufacturer: *; Manufacturer Part Number: *; Distributor Link: *; LCSC: *
SD1 = SD-106M: [C266603]
SD2 = TF-01A: [C2889258]
U27 = GL3224-OIY04: [C157357]
U28 = W25X20CLSNIG: [C409019]
U29 = AP22615AWU-7: [C2680357]
X5 = TSX-3225_24.0000MF15X-AC: as X2 on sheet USB_HUB1 DN PORT 3

## Sheet USB_HUB1 DN PORT 5.SchDoc: USB_HUB 3.0
size A3; DrawnBy: Luca Schenetti; Engineer: Luca Schenetti; Revision: A; SheetNumber: 10; SheetTotal: 10
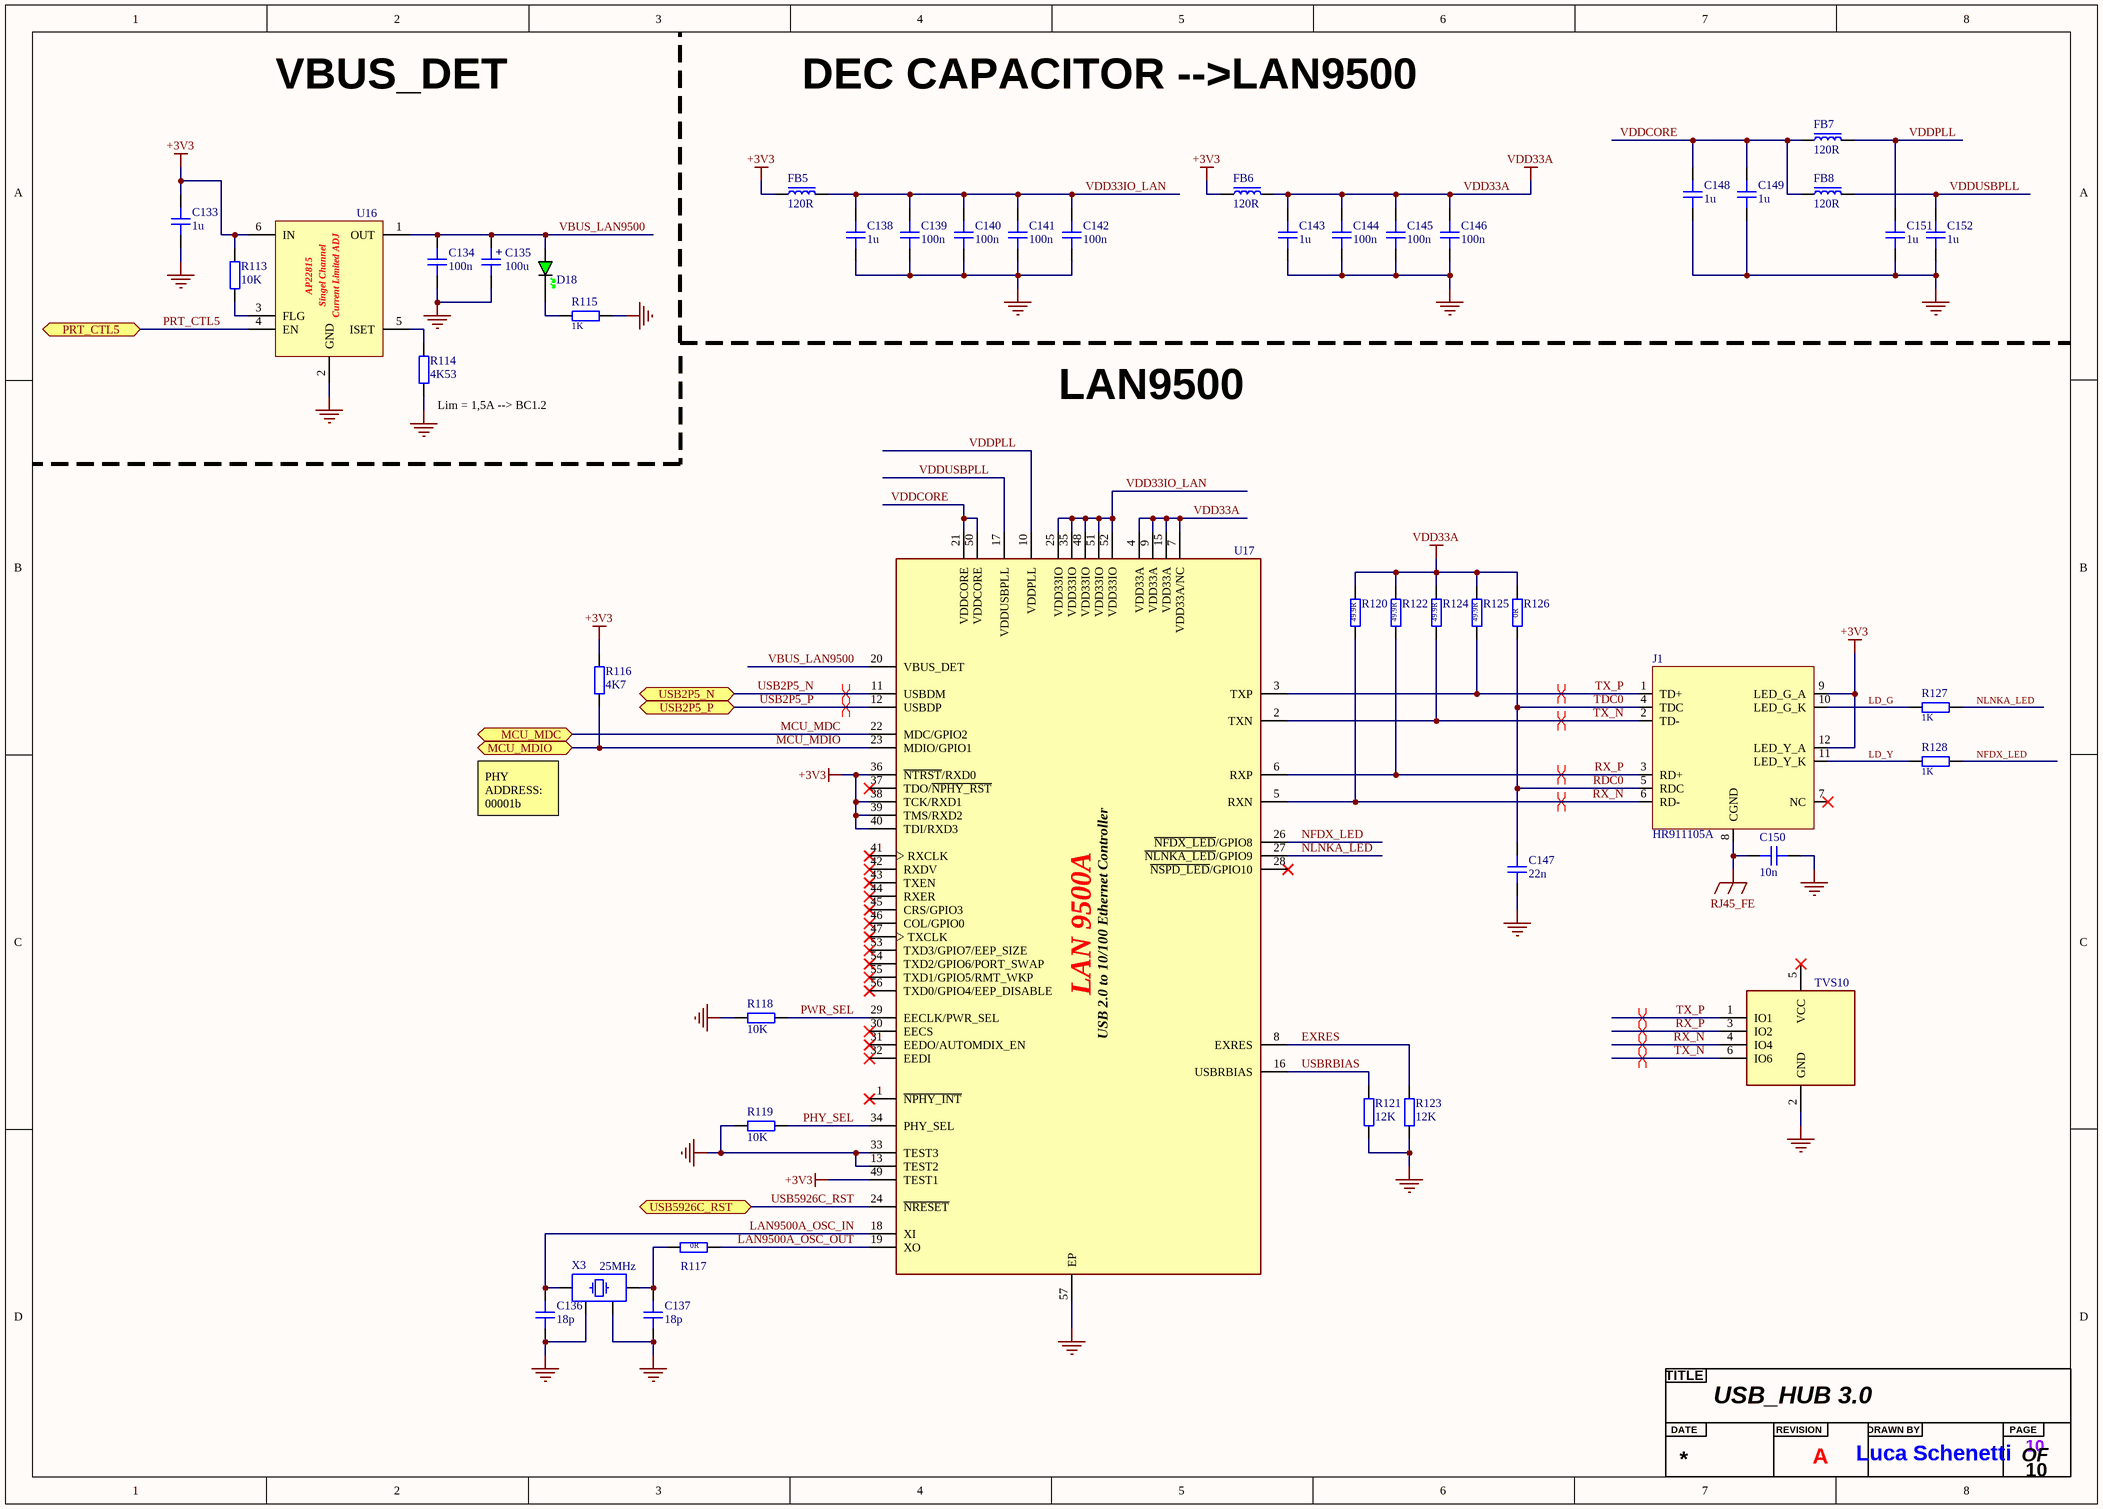
[diagram p16: USB_HUB1 DN PORT 5.SchDoc]

### Parts
(Parts that share a designator on the sheet are numbered #1, #2 ... from top to bottom, then left to right.)
?#10  Title  (value not drawn)  (graphical)
C133  1u  [CAP_0603]
C134  100n  [CAP_0603]
C135  100u  [CAP_AE_SMD_D6MM3_H5M55]
C136  18p  [CAP_0402]
C137  18p  [CAP_0402]
C138  1u  [CAP_0603]
C139  100n  [CAP_0603]
C140  100n  [CAP_0603]
C141  100n  [CAP_0603]
C142  100n  [CAP_0603]
C143  1u  [CAP_0603]
C144  100n  [CAP_0603]
C145  100n  [CAP_0603]
C146  100n  [CAP_0603]
C147  22n  [CAP_0603]
C148  1u  [CAP_0603]
C149  1u  [CAP_0603]
C150  10n  [CAP_1206]
C151  1u  [CAP_0603]
C152  1u  [CAP_0603]
D18  GREEN  [LED_0603_GREEN]  (value not drawn)
FB5  120R  [FB_0603]
FB6  120R  [FB_0603]
FB7  120R  [FB_0603]
FB8  120R  [FB_0603]
J1  HR911105A  [HR911105A]
R113  10K  [RES_0603]
R114  4K53  [RES_0603]
R115  1K  [RES_0603]
R116  4K7  [RES_0603]
R117  0R  [RES_0402]
R118  10K  [RES_0603]
R119  10K  [RES_0603]
R120  49.9R  [RES_0402]
R121  12K  [RES_0603]
R122  49.9R  [RES_0402]
R123  12K  [RES_0603]
R124  49.9R  [RES_0402]
R125  49.9R  [RES_0402]
R126  0R  [RES_0402]
R127  1K  [RES_0603]
R128  1K  [RES_0603]
TVS10  ESD 5A 75W 12.5V 6V Bidirectional 5V  [SRV05-4]  (value not drawn)
U16  Single-Channel, Current-Limited,ISET  [AP22615AWU-7]  (value not drawn)
U17  USB 2.0 to 10/100 Ethernet  [LAN9500A-ABZJ-TR]  (value not drawn)
X3  25MHz  [XTAL_3225]

### Ports
MCU_MDC (bidir, see MCU[4C]), MCU_MDIO (bidir, see MCU[4C]), PRT_CTL5 (bidir, see USB_HUB1[6D]), USB2P5_N (bidir, see USB_HUB1[6D]), USB2P5_P (bidir, see USB_HUB1[6D]), USB5926C_RST (bidir, see MCU[8C], USB_HUB1 DN PORT 1_2[5B], USB_HUB1 DN PORT 1_2[5D], USB_HUB1 DN PORT 6[1C], USB_HUB1 UP PORT0[5C], USB_HUB1[3C])

### Nets
+3V3: C133.2 FB5.1 FB6.1 J1.9(LED_G_A) J1.12(LED_Y_A) R113.2 R116.2 U16.6(IN) U17.36(~{NTRST}/RXD0) U17.38(TCK/RXD1) U17.39(TMS/RXD2) U17.40(TDI/RXD3) U17.49(TEST1)
GND: C133.1 C134.1 C135.2 C136.1 C137.1 C138.1 C139.1 C140.1 C141.1 C142.1 C143.1 C144.1 C145.1 C146.1 C147.1 C148.1 C149.1 C150.2 C151.1 C152.1 R114.1 R115.2 R118.2 R119.2 R121.1 R123.1 TVS10.2(GND) U16.2(GND) U17.13(TEST2) U17.33(TEST3) U17.57(EP) X3.2 X3.4
RJ45_FE: C150.1 J1.8(CGND)
VDD33A: C143.2 C144.2 C145.2 C146.2 FB6.2 R120.2 R122.2 R124.2 R125.2 R126.2 U17.4(VDD33A) U17.7(VDD33A/NC) U17.9(VDD33A) U17.15(VDD33A)
EXRES: R123.2 U17.8(EXRES)
LAN9500A_OSC_IN: C136.2 U17.18(XI) X3.3
LAN9500A_OSC_OUT: R117.2 U17.19(XO)
LD_G: J1.10(LED_G_K) R127.1
LD_Y: J1.11(LED_Y_K) R128.1
MCU_MDC: U17.22(MDC/GPIO2) ; port MCU_MDC
MCU_MDIO: R116.1 U17.23(MDIO/GPIO1) ; port MCU_MDIO
NFDX_LED: R128.2 U17.26(~{NFDX_LED}/GPIO8)
NLNKA_LED: R127.2 U17.27(~{NLNKA_LED}/GPIO9)
PHY_SEL: R119.1 U17.34(PHY_SEL)
PRT_CTL5: U16.4(EN) ; port PRT_CTL5
PWR_SEL: R118.1 U17.29(EECLK/PWR_SEL)
RDC0: C147.2 J1.4(TDC) J1.5(RDC) R126.1  [also labelled TDC0]
RX_N: J1.6(RD-) R120.1 TVS10.4(IO4) U17.5(RXN)
RX_P: J1.3(RD+) R122.1 TVS10.3(IO2) U17.6(RXP)
TX_N: J1.2(TD-) R124.1 TVS10.6(IO6) U17.2(TXN)
TX_P: J1.1(TD+) R125.1 TVS10.1(IO1) U17.3(TXP)
USB2P5_N: U17.11(USBDM) ; port USB2P5_N
USB2P5_P: U17.12(USBDP) ; port USB2P5_P
USB5926C_RST: U17.24(~{NRESET}) ; port USB5926C_RST
USBRBIAS: R121.2 U17.16(USBRBIAS)
VBUS_LAN9500: C134.2 C135.1 D18.A U16.1(OUT) U17.20(VBUS_DET)
VDD33IO_LAN: C138.2 C139.2 C140.2 C141.2 C142.2 FB5.2 U17.25(VDD33IO) U17.35(VDD33IO) U17.48(VDD33IO) U17.51(VDD33IO) U17.52(VDD33IO)
VDDCORE: C148.2 C149.2 FB7.1 FB8.1 U17.21(VDDCORE) U17.50(VDDCORE)
VDDPLL: C151.2 FB7.2 U17.10(VDDPLL)
VDDUSBPLL: C152.2 FB8.2 U17.17(VDDUSBPLL)
NetC137_2: C137.2 R117.1 X3.1
NetD18_K: D18.K R115.1
NetR113_1: R113.1 U16.3(FLG)
NetR114_2: R114.2 U16.5(ISET)

Not connected (* = marked no-connect by the designer): J1 7(NC)*; TVS10 5(VCC)*; U17 1(~{NPHY_INT})* 28(~{NSPD_LED}/GPIO10)* 30(EECS)* 31(EEDO/AUTOMDIX_EN)* 32(EEDI)* 37(TDO/~{NPHY_RST})* 41(RXCLK)* 42(RXDV)* 43(TXEN)* 44(RXER)* 45(CRS/GPIO3)* 46(COL/GPIO0)* 47(TXCLK)* 53(TXD3/GPIO7/EEP_SIZE)* 54(TXD2/GPIO6/PORT_SWAP)* 55(TXD1/GPIO5/RMT_WKP)* 56(TXD0/GPIO4/EEP_DISABLE)*

### Layout directives
differential pair; differential pair class DIFF_MDI_100Ω: RX_N, RX_P, TX_N, TX_P
differential pair; differential pair class DIFF_USB_90Ω: USB2P5_N, USB2P5_P

### Notes on the sheet
- VBUS_DET
- DEC CAPACITOR -->LAN9500
- (near R114) Lim = 1,5A --> BC1.2
- LAN9500
- PHY ADDRESS: 00001b
- (in symbol AP22615AWU-7) AP22815; Singel Channel; Current Limited ADJ
- (in symbol CAP_ALEL_6.3x5.5) +
- (in symbol LAN9500A-ABZJ-TR) LAN 9500A; USB 2.0 to 10/100 Ethernet Controller
- (in symbol Title) TITLE; DATE; REVISION; DRAWN BY; PAGE; OF

### Library data of the parts
C133 C138 C143 C148 C149 C151 C152 = CAP_0603: Capacitor SMD 0603 [C15849]; Manufacturer: *; Manufacturer Part Number: *; Distributor Link: *; LCSC: *; Rating: *; Dielectric: *
C134 C139-C142 C144-C146 = CAP_0603: Capacitor SMD 0603 [C14663]; Manufacturer: *; Manufacturer Part Number: *; Distributor Link: *; LCSC: *; Rating: *; Dielectric: *
C135 = CAP_ALEL_6.3x5.5: [C59936]; Manufacturer: *; Manufacturer Part Number: *; Distributor Link: *; LCSC: *
C136 C137 = CAP_0402: Capacitor SMD 0402 [C1549]; Manufacturer: *; Manufacturer Part Number: *; Distributor Link: *; LCSC: *; Rating: *; Dielectric: *
C147 = CAP_0603: Capacitor SMD 0603 [C21122]; Manufacturer: *; Manufacturer Part Number: *; Distributor Link: *; LCSC: *; Rating: *; Dielectric: *
C150 = CAP_1206: [C1846]; Manufacturer: *; Manufacturer Part Number: *; Distributor Link: *; LCSC: *; Rating: *; Dielectric: *
D18 = LED_0603_GREEN: [C2986059]
FB5-FB8 = FB_0603: Ferrite Bead SMD 0603[C76892]; Manufacturer: *; Manufacturer Part Number: *; Distributor Link: *; LCSC: *
J1 = HR911105A: Single Port RJ45 Connector w/ Integrated Magnetic and LED 10/100 Base-T [C12074]; Manufacturer: HanRun; Manufacturer Part Number: HR911105A
R113 R118 R119 = RES_0603: [C25804]; Manufacturer: *; Manufacturer Part Number: *; Distributor Link: *; LCSC: *
R114 = RES_0603: [C25971]; Manufacturer: *; Manufacturer Part Number: *; Distributor Link: *; LCSC: *
R115 R127 R128 = RES_0603: [C21190]; Manufacturer: *; Manufacturer Part Number: *; Distributor Link: *; LCSC: *
R116 = RES_0603: [C23162]; Manufacturer: *; Manufacturer Part Number: *; Distributor Link: *; LCSC: *
R117 = RES_0402: Resistor SMD 0402 [C17168]; Manufacturer: *; Manufacturer Part Number: *; Distributor Link: *; LCSC: *
R120 R122 R124 R125 = RES_0402: [C25120]; Manufacturer: *; Manufacturer Part Number: *; Distributor Link: *; LCSC: *
R121 R123 = RES_0603: [C22790]; Manufacturer: *; Manufacturer Part Number: *; Distributor Link: *; LCSC: *
R126 = RES_0402: [C17168]; Manufacturer: *; Manufacturer Part Number: *; Distributor Link: *; LCSC: *
TVS10 = SRV05-4: [C7420376]
U16 = AP22615AWU-7: [C2680357]
U17 = LAN9500A-ABZJ-TR: [C2651877]
X3 = TSX-3225_24.0000MF15X-AC: as X2 on sheet USB_HUB1 DN PORT 3